# EAGLE design PQ60-EPS (EAGLE 7.2.0)
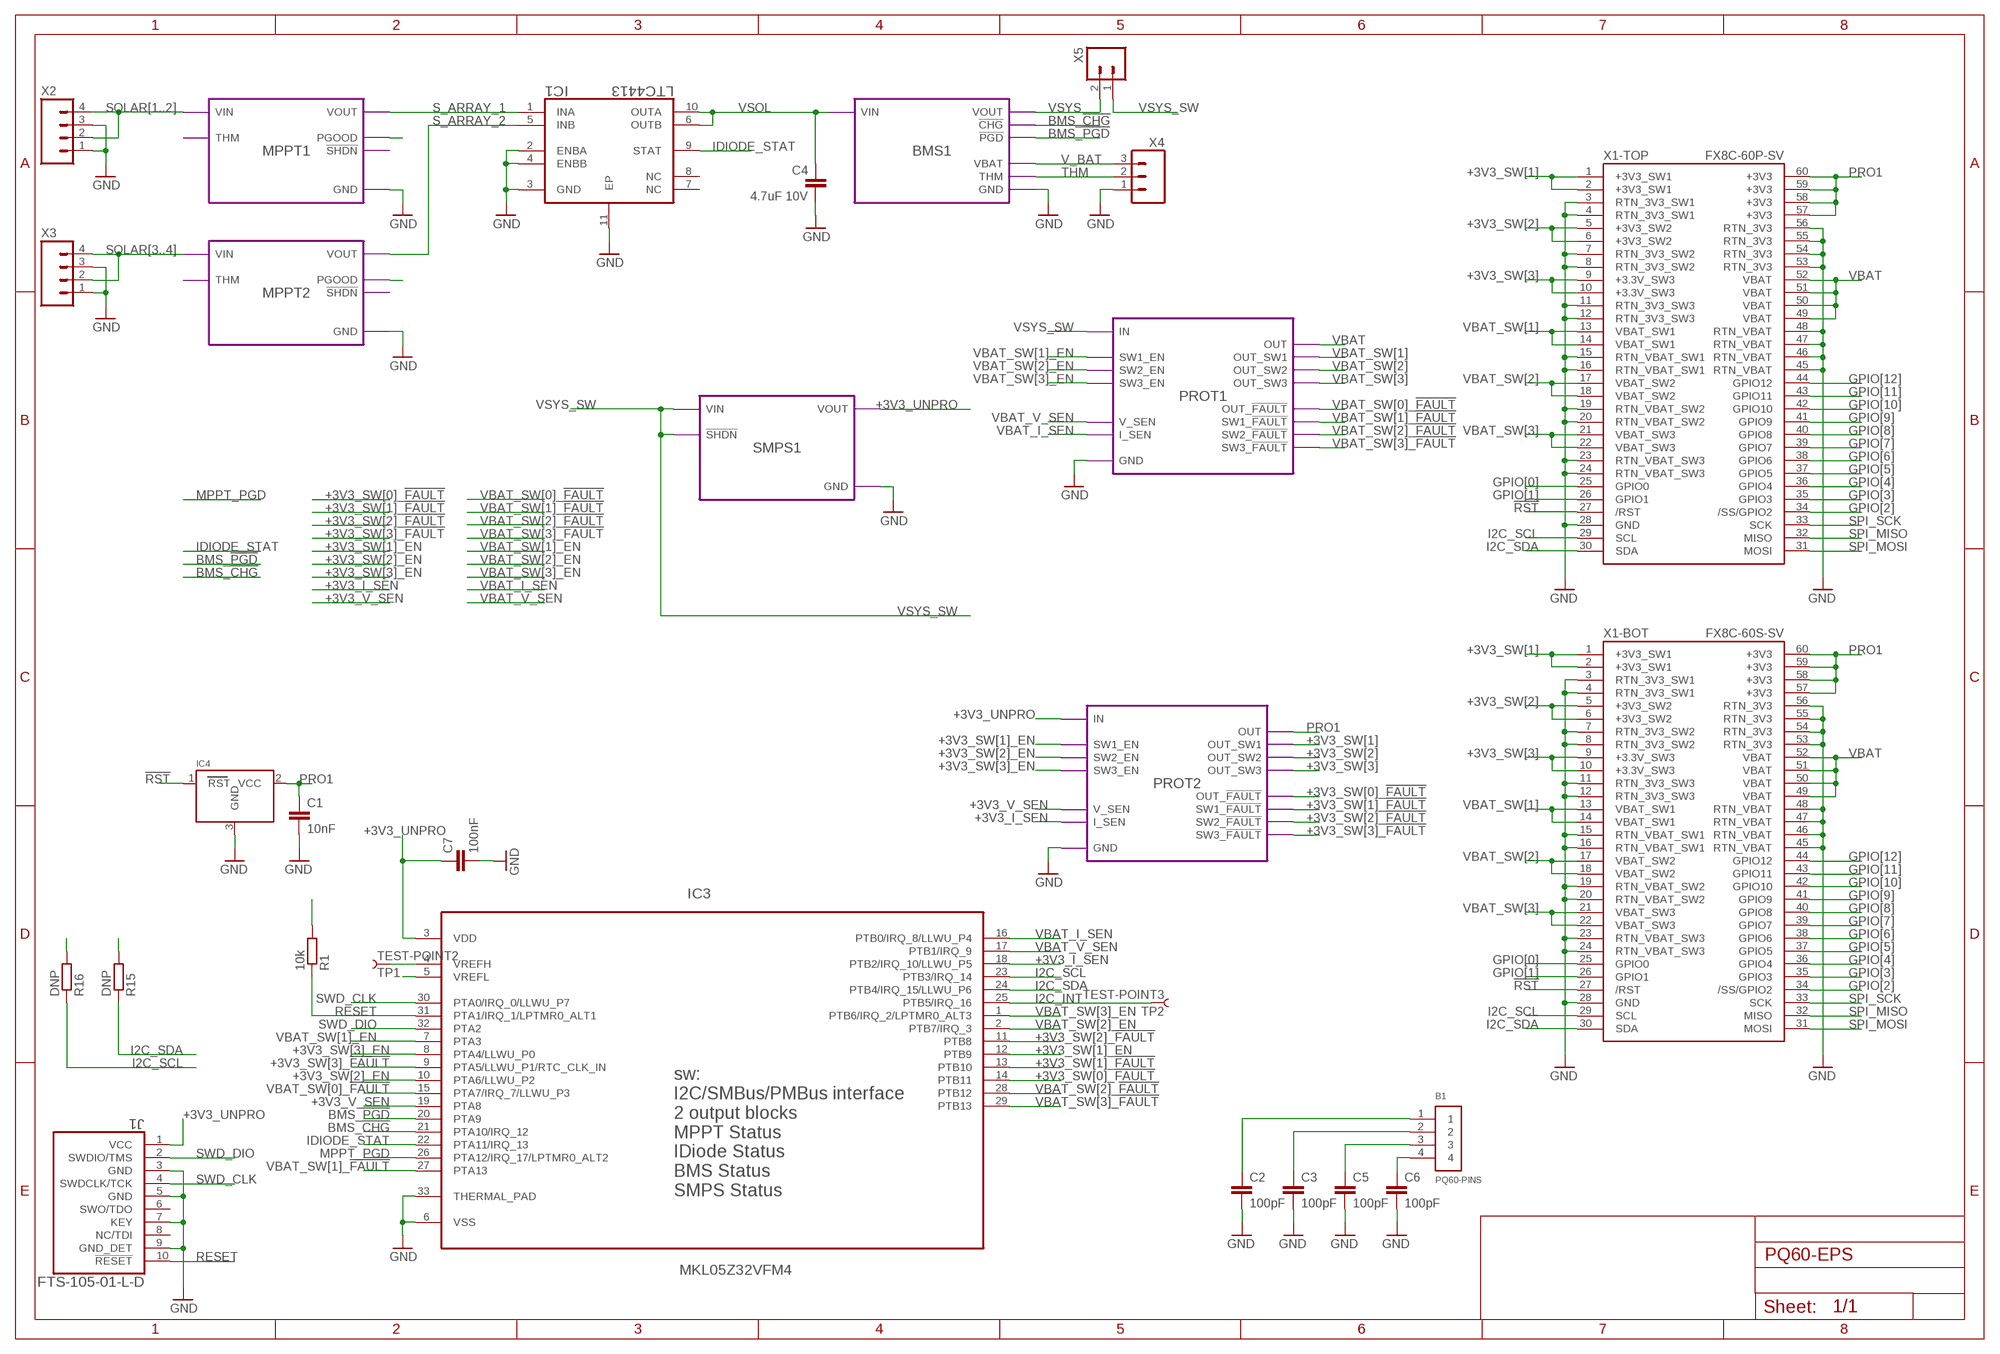
[diagram p0: schematic, sheet 1]

## Parts
B1  PQ60-PINS  [PQ60_PINS]
C1  10nF  C-EUC0603  [C0603]
C2  100pF  C-EUC0402  [C0402]
C3  100pF  C-EUC0402  [C0402]
C4  4.7uF 10V  C-EUC0805  [C0805]
C5  100pF  C-EUC0402  [C0402]
C6  100pF  C-EUC0402  [C0402]
C7  100nF  C-EUC0603  [C0603]
IC1  LTC4413  LTC4413EDDPBF  [DFN300X300X80-11N]
IC3  MKL05Z32VFM4  [QFN50P500X500X100-33N]
IC4  MCP130TREFLOW  [SOT23-R]
J1  FTS-105-01-L-D  [SAMTEC_FTS-105-01-L-D]
R1  10k  R-EU_R0603  [R0603]
R15  DNP  R-EU_R0603  [R0603]
R16  DNP  R-EU_R0603  [R0603]
TP1  TEST-POINT2  [PAD.02X.02]
TP2  TEST-POINT3  [PAD.03X.03]
X1-BOT  FX8C-60S-SV  FX8C-60-R2S-SV  [FX8C-60S-SV]
X1-TOP  FX8C-60P-SV  FX8C-60-R2P-SV  [FX8C-60P-SV]
X2  M04SMD2  [1X04-1MM-RA]
X3  M04SMD2  [1X04-1MM-RA]
X4  M03SMD  [1X03-1MM-RA]
X5  M02SMD  [1X02-1MM-RA]

## Module instances
MPPT1 = MPPT
MPPT2 = MPPT
SMPS1 = SMPS
BMS1 = BMS
PROT1 = PROT
PROT2 = PROT

## Nets
!RST: IC4.1(RST) X1-BOT.27(/RST) X1-TOP.27(/RST)
+3V3_I_SEN: IC3.18(PTB2/IRQ_10/LLWU_P5) ; port PROT2.I_SEN
+3V3_SW[0]_!FAULT!: IC3.14(PTB11) ; port PROT2.OUT_!FAULT!
+3V3_SW[1]: X1-BOT.1(+3V3_SW1) X1-BOT.2(+3V3_SW1) X1-TOP.1(+3V3_SW1) X1-TOP.2(+3V3_SW1) ; port PROT2.OUT_SW1
+3V3_SW[1]_!FAULT!: IC3.13(PTB10) ; port PROT2.SW1_!FAULT!
+3V3_SW[1]_EN: IC3.12(PTB9) ; port PROT2.SW1_EN
+3V3_SW[2]: X1-BOT.5(+3V3_SW2) X1-BOT.6(+3V3_SW2) X1-TOP.5(+3V3_SW2) X1-TOP.6(+3V3_SW2) ; port PROT2.OUT_SW2
+3V3_SW[2]_!FAULT!: IC3.11(PTB8) ; port PROT2.SW2_!FAULT!
+3V3_SW[2]_EN: IC3.10(PTA6/LLWU_P2) ; port PROT2.SW2_EN
+3V3_SW[3]: X1-BOT.9(+3.3V_SW3) X1-BOT.10(+3.3V_SW3) X1-TOP.9(+3.3V_SW3) X1-TOP.10(+3.3V_SW3) ; port PROT2.OUT_SW3
+3V3_SW[3]_!FAULT!: IC3.9(PTA5/LLWU_P1/RTC_CLK_IN) ; port PROT2.SW3_!FAULT!
+3V3_SW[3]_EN: IC3.8(PTA4/LLWU_P0) ; port PROT2.SW3_EN
+3V3_UNPRO: C7.1 IC3.3(VDD) J1.1(VCC) R1.2 ; port SMPS1.VOUT PROT2.IN
+3V3_V_SEN: IC3.19(PTA8) ; port PROT2.V_SEN
BMS_!CHG!: IC3.21(PTA10/IRQ_12) ; port BMS1.!CHG
BMS_!PGD!: IC3.20(PTA9) ; port BMS1.!PGD
GND: C1.2 C2.2 C3.2 C4.2 C5.2 C6.2 C7.2 IC1.2(ENBA) IC1.3(GND) IC1.4(ENBB) IC1.11(EP) IC3.5(VREFL) IC3.6(VSS) IC3.33(THERMAL_PAD) IC4.3(GND) J1.3(GND) J1.5(GND) J1.7(KEY) J1.9(GND_DET) X1-BOT.3(RTN_3V3_SW1) X1-BOT.4(RTN_3V3_SW1) X1-BOT.7(RTN_3V3_SW2) X1-BOT.8(RTN_3V3_SW2) X1-BOT.11(RTN_3V3_SW3) X1-BOT.12(RTN_3V3_SW3) X1-BOT.15(RTN_VBAT_SW1) X1-BOT.16(RTN_VBAT_SW1) X1-BOT.19(RTN_VBAT_SW2) X1-BOT.20(RTN_VBAT_SW2) X1-BOT.23(RTN_VBAT_SW3) X1-BOT.24(RTN_VBAT_SW3) X1-BOT.28(GND) X1-BOT.45(RTN_VBAT) X1-BOT.46(RTN_VBAT) X1-BOT.47(RTN_VBAT) X1-BOT.48(RTN_VBAT) X1-BOT.53(RTN_3V3) X1-BOT.54(RTN_3V3) X1-BOT.55(RTN_3V3) X1-BOT.56(RTN_3V3) X1-TOP.3(RTN_3V3_SW1) X1-TOP.4(RTN_3V3_SW1) X1-TOP.7(RTN_3V3_SW2) X1-TOP.8(RTN_3V3_SW2) X1-TOP.11(RTN_3V3_SW3) X1-TOP.12(RTN_3V3_SW3) X1-TOP.15(RTN_VBAT_SW1) X1-TOP.16(RTN_VBAT_SW1) X1-TOP.19(RTN_VBAT_SW2) X1-TOP.20(RTN_VBAT_SW2) X1-TOP.23(RTN_VBAT_SW3) X1-TOP.24(RTN_VBAT_SW3) X1-TOP.28(GND) X1-TOP.45(RTN_VBAT) X1-TOP.46(RTN_VBAT) X1-TOP.47(RTN_VBAT) X1-TOP.48(RTN_VBAT) X1-TOP.53(RTN_3V3) X1-TOP.54(RTN_3V3) X1-TOP.55(RTN_3V3) X1-TOP.56(RTN_3V3) X2.1 X2.3 X3.1 X3.3 X4.1 ; port MPPT1.GND MPPT2.GND SMPS1.GND BMS1.GND PROT1.GND PROT2.GND
GPIO[0]: X1-BOT.25(GPIO0) X1-TOP.25(GPIO0)
GPIO[1]: X1-BOT.26(GPIO1) X1-TOP.26(GPIO1)
GPIO[2]: X1-BOT.34(/SS/GPIO2) X1-TOP.34(/SS/GPIO2)
GPIO[3]: X1-BOT.35(GPIO3) X1-TOP.35(GPIO3)
GPIO[4]: X1-BOT.36(GPIO4) X1-TOP.36(GPIO4)
GPIO[5]: X1-BOT.37(GPIO5) X1-TOP.37(GPIO5)
GPIO[6]: X1-BOT.38(GPIO6) X1-TOP.38(GPIO6)
GPIO[7]: X1-BOT.39(GPIO7) X1-TOP.39(GPIO7)
GPIO[8]: X1-BOT.40(GPIO8) X1-TOP.40(GPIO8)
GPIO[9]: X1-BOT.41(GPIO9) X1-TOP.41(GPIO9)
GPIO[10]: X1-BOT.42(GPIO10) X1-TOP.42(GPIO10)
GPIO[11]: X1-BOT.43(GPIO11) X1-TOP.43(GPIO11)
GPIO[12]: X1-BOT.44(GPIO12) X1-TOP.44(GPIO12)
I2C_INT: IC3.25(PTB5/IRQ_16) TP2.P$1
I2C_SCL: IC3.23(PTB3/IRQ_14) R16.1 X1-BOT.29(SCL) X1-TOP.29(SCL)
I2C_SDA: IC3.24(PTB4/IRQ_15/LLWU_P6) R15.1 X1-BOT.30(SDA) X1-TOP.30(SDA)
IDIODE_STAT: IC1.9(STAT) IC3.22(PTA11/IRQ_13)
MPPT_PGD: IC3.26(PTA12/IRQ_17/LPTMR0_ALT2) ; port MPPT1.PGOOD MPPT2.PGOOD
N$1: B1.1 C2.1
N$2: B1.2 C3.1
N$3: B1.3 C5.1
N$4: B1.4 C6.1
N$5: IC3.4(VREFH) TP1.P$1
PRO1: C1.1 IC4.2(VCC) R15.2 R16.2 X1-BOT.57(+3V3) X1-BOT.58(+3V3) X1-BOT.59(+3V3) X1-BOT.60(+3V3) X1-TOP.57(+3V3) X1-TOP.58(+3V3) X1-TOP.59(+3V3) X1-TOP.60(+3V3) ; port PROT2.OUT
RESET: IC3.31(PTA1/IRQ_1/LPTMR0_ALT1) J1.10(!RESET) R1.1
S_ARRAY_1: IC1.1(INA) ; port MPPT1.VOUT
S_ARRAY_2: IC1.5(INB) ; port MPPT2.VOUT
SOLAR[1..2]: X2.2 X2.4 ; port MPPT1.VIN
SOLAR[3..4]: X3.2 X3.4 ; port MPPT2.VIN
SPI_MISO: X1-BOT.32(MISO) X1-TOP.32(MISO)
SPI_MOSI: X1-BOT.31(MOSI) X1-TOP.31(MOSI)
SPI_SCK: X1-BOT.33(SCK) X1-TOP.33(SCK)
SWD_CLK: IC3.30(PTA0/IRQ_0/LLWU_P7) J1.4(SWDCLK/TCK)
SWD_DIO: IC3.32(PTA2) J1.2(SWDIO/TMS)
THM: X4.2 ; port BMS1.THM
V_BAT: X4.3 ; port BMS1.VBAT
VBAT: X1-BOT.49(VBAT) X1-BOT.50(VBAT) X1-BOT.51(VBAT) X1-BOT.52(VBAT) X1-TOP.49(VBAT) X1-TOP.50(VBAT) X1-TOP.51(VBAT) X1-TOP.52(VBAT) ; port PROT1.OUT
VBAT_I_SEN: IC3.16(PTB0/IRQ_8/LLWU_P4) ; port PROT1.I_SEN
VBAT_SW[0]_!FAULT!: IC3.15(PTA7/IRQ_7/LLWU_P3) ; port PROT1.OUT_!FAULT!
VBAT_SW[1]: X1-BOT.13(VBAT_SW1) X1-BOT.14(VBAT_SW1) X1-TOP.13(VBAT_SW1) X1-TOP.14(VBAT_SW1) ; port PROT1.OUT_SW1
VBAT_SW[1]_!FAULT!: IC3.27(PTA13) ; port PROT1.SW1_!FAULT!
VBAT_SW[1]_EN: IC3.7(PTA3) ; port PROT1.SW1_EN
VBAT_SW[2]: X1-BOT.17(VBAT_SW2) X1-BOT.18(VBAT_SW2) X1-TOP.17(VBAT_SW2) X1-TOP.18(VBAT_SW2) ; port PROT1.OUT_SW2
VBAT_SW[2]_!FAULT!: IC3.28(PTB12) ; port PROT1.SW2_!FAULT!
VBAT_SW[2]_EN: IC3.2(PTB7/IRQ_3) ; port PROT1.SW2_EN
VBAT_SW[3]: X1-BOT.21(VBAT_SW3) X1-BOT.22(VBAT_SW3) X1-TOP.21(VBAT_SW3) X1-TOP.22(VBAT_SW3) ; port PROT1.OUT_SW3
VBAT_SW[3]_!FAULT!: IC3.29(PTB13) ; port PROT1.SW3_!FAULT!
VBAT_SW[3]_EN: IC3.1(PTB6/IRQ_2/LPTMR0_ALT3) ; port PROT1.SW3_EN
VBAT_V_SEN: IC3.17(PTB1/IRQ_9) ; port PROT1.V_SEN
VSOL: C4.1 IC1.6(OUTB) IC1.10(OUTA) ; port BMS1.VIN
VSYS: X5.2 ; port BMS1.VOUT
VSYS_SW: X5.1 ; port SMPS1.VIN SMPS1.!SHDN PROT1.IN
Unconnected: IC1.7(NC) IC1.8(NC) J1.6(SWO/TDO) J1.8(NC/TDI)

## Notes on the sheet
- sw:
  I2C/SMBus/PMBus interface
  2 output blocks
  MPPT Status
  IDiode Status
  BMS Status
  SMPS Status

## Library data of the parts
B1 = general:PQ60-PINS; OC_FARNELL: unknown
C1 C4 = rcl:C-EU: CAPACITOR, European symbol; OC_FARNELL: unknown
C2 C3 C5 C6 = rcl:C-EU: CAPACITOR, European symbol; MF: AVX; MPN: 02013A101JAT2A; OC_FARNELL: 2280754
C7 = rcl:C-EU: CAPACITOR, European symbol
IC1 = general:LTC4413EDDPBF: Dual 2.6A, 2.5V to 5.5V, Ideal Diodes; MF: LINEAR TECHNOLOGY; MPN: LTC4413EDD#PBF; OC_FARNELL: 1663736; OC_NEWARK: 56M9529; PACKAGE: DFN-10; SUPPLIER: Linear Technology
IC3 = general:MKL05Z32VFM4: MCU, KINETIS L, CORTEX M0+, QFN-32; MF: FREESCALE SEMICONDUCTOR; MPN: MKL05Z32VFM4; OC_FARNELL: 2253370; OC_NEWARK: 53W0789; PACKAGE: QFN-32; SUPPLIER: FREESCALE SEMICONDUCTOR
IC4 = microbuilder:MCP130T: MCP130T Voltage Supervisor (Active Low) Voltage supervisors will put the MCU in a reset state if the voltage drops below a pre-determined level. SOT23-R/SOT23-W: Voltage Supervisor - 3.15V Active Low Note: Use the "Reflow" footprint when working with solder paste, and the "Wave" footprint when soldering by hand with a soldering iron (the latter has larger pads that are easier to solder by hand). Digikey: MCP130T-315I/TTCT-ND; OC_FARNELL: unknown
J1 = general:FTS-105-01-L-; DESCRIPTION: Through Hole Post Header; MF: SAMTEC; MPN: FTS-105-01-L-D; OC_FARNELL: 1667728; OC_NEWARK: 11P4652; PACKAGE: CONN HEADER 10POS DUAL .05" THR; SUPPLIER: Samtec
R1 R15 R16 = rcl:R-EU_: RESISTOR, European symbol; OC_FARNELL: unknown
TP1 TP2 = SparkFun-Passives:TEST-POINT: Bare copper test points for troubleshooting or ICT
X1-BOT X1-TOP = PQ60:FX8C-60-R2; OC_FARNELL: unknown
X2 X3 = SparkFun-Connectors:M04: Header 4 Standard 4-pin 0.1" header. Use with straight break away headers (SKU : PRT-00116), right angle break away headers (PRT-00553), swiss pins (PRT-00743), machine pins (PRT-00117), and female headers (PRT-00115). Molex polarized connector foot print use with SKU : PRT-08231 with associated crimp pins and housings. 1MM SMD Version SKU: PRT-10208; OC_FARNELL: unknown
X4 = SparkFun-Connectors:M03: Header 3 Standard 3-pin 0.1" header. Use with straight break away headers (SKU : PRT-00116), right angle break away headers (PRT-00553), swiss pins (PRT-00743), machine pins (PRT-00117), and female headers (PRT-00115). Molex polarized connector foot print use with SKU : PRT-08232 with associated crimp pins and housings.; OC_FARNELL: unknown
X5 = SparkFun-Connectors:M02: Standard 2-pin 0.1" header. Use with - straight break away headers ( PRT-00116) - right angle break away headers (PRT-00553) - swiss pins (PRT-00743) - machine pins (PRT-00117) - female headers (PRT-00115) Molex polarized connector foot print use with: PRT-08233 with associated crimp pins and housings. 2.54_SCREWTERM for use with PRT-10571. 3.5mm Screw Terminal footprints for PRT-08084 5mm Screw Terminal footprints for use with PRT-08432; OC_FARNELL: unknown

## Module MPPT
Ports: GND(pwr) VOUT(out) VIN(in) THM(in) PGOOD(out) !SHDN!(in)
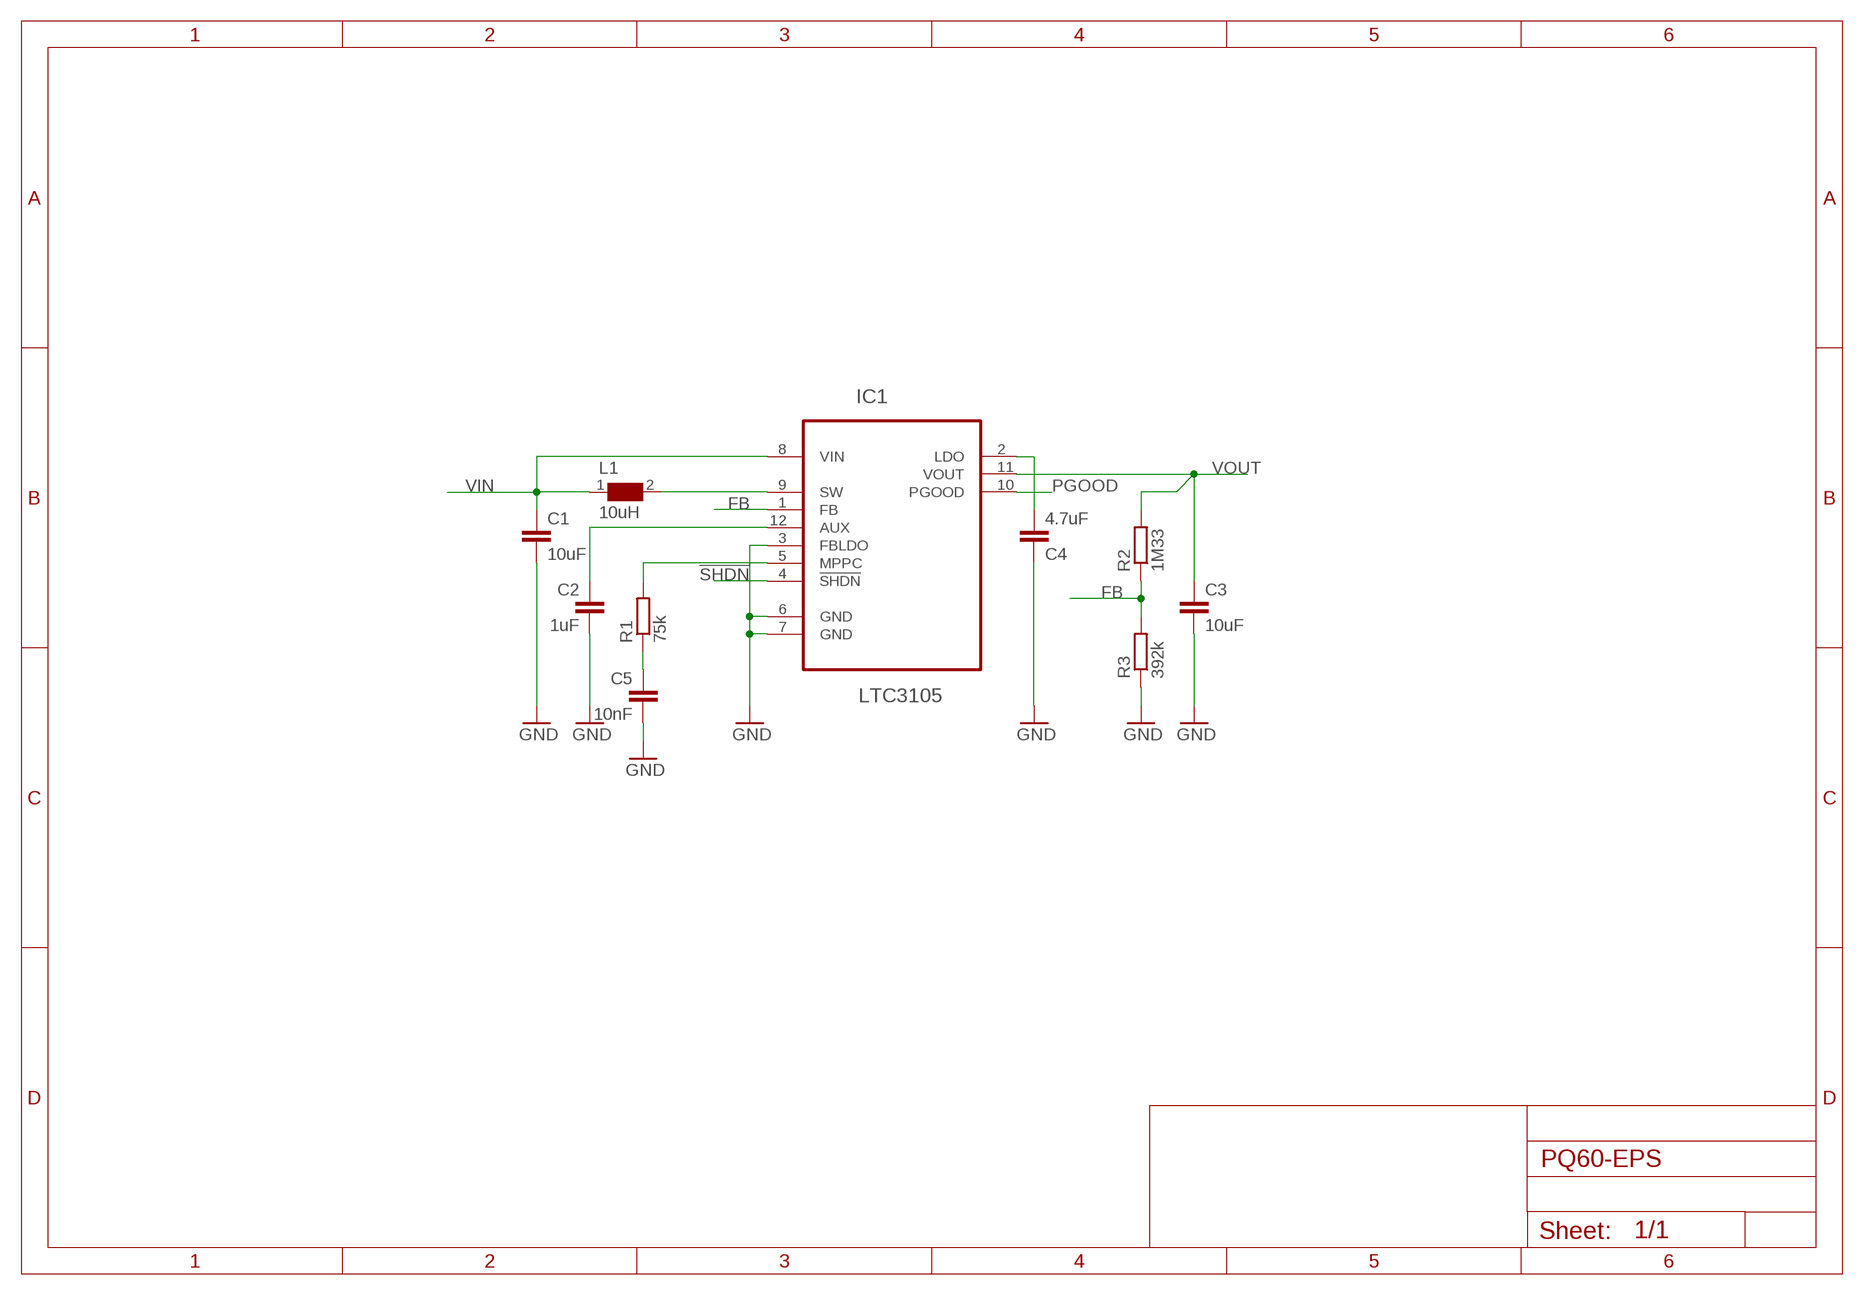
[diagram p1: schematic, module MPPT, sheet 1]

### Parts
C1  10uF  C-EUC0603  [C0603]
C2  1uF  C-EUC0603  [C0603]
C3  10uF  C-EUC0603  [C0603]
C4  4.7uF  C-EUC0603  [C0603]
C5  10nF  C-EUC0603  [C0603]
IC1  LTC3105  LTC3105EMSPBF  [SOP65P490X110-12N]
L1  10uH  WE-TPC-744031100_3816  [WE-TPC_3816]
R1  75k  R-EU_R0603  [R0603]
R2  1M33  R-EU_R0603  [R0603]
R3  392k  R-EU_R0603  [R0603]

### Nets
!SHDN!: IC1.4(!SHDN!)
AUX: C2.1 IC1.12(AUX)
FB: IC1.1(FB) R2.1 R3.2
GND: C1.2 C2.2 C3.2 C4.1 C5.2 IC1.3(FBLDO) IC1.6(GND) IC1.7(GND) R3.1
LDO: C4.2 IC1.2(LDO)
MPPC: IC1.5(MPPC) R1.2
PGOOD: IC1.10(PGOOD)
SW: IC1.9(SW) L1.2
THM: C5.1 R1.1
VIN: C1.1 IC1.8(VIN) L1.1
VOUT: C3.1 IC1.11(VOUT) R2.2

### Library data of the parts
C1 C3-C5 = rcl:C-EU: CAPACITOR, European symbol; OC_FARNELL: unknown
C2 = rcl:C-EU: CAPACITOR, European symbol; MF: AVX; MPN: 02016D105MAT2A; OC_FARNELL: 1867951RL
IC1 = general:LTC3105EMSPBF: DC/DC Converter; MF: LINEAR TECHNOLOGY; MPN: LTC3105EMS#PBF; OC_FARNELL: 1898601; OC_NEWARK: 27T5811; PACKAGE: MSOP-12; SUPPLIER: Linear Technology
L1 = WE-TPC:WE-TPC: Shielded Tiny Power Inductor WE-TPC - Extremely flat power inductor - High current capability - High reliability and perfect soldering characteristics because of integrated soldering pad - magnetically shielded -- Portable power like PDA, digital camera, PCMICA-cards and displays -- DC/DC-converter -- Recommended for switching regulator IC's from Linear Technology, National Semiconductor, Texas Instruments and Fairchild Semiconductor; MF: WURTH ELEKTRONIK; MPN: 744031100; OC_FARNELL: 1635835; OC_NEWARK: 08P2474; PACKAGE: 3816; SUPPLIER: WURTH ELEKTRONIK
R1-R3 = rcl:R-EU_: RESISTOR, European symbol; OC_FARNELL: unknown

## Module SMPS
Ports: VIN(in) VOUT(out) GND(pwr) !SHDN(in)
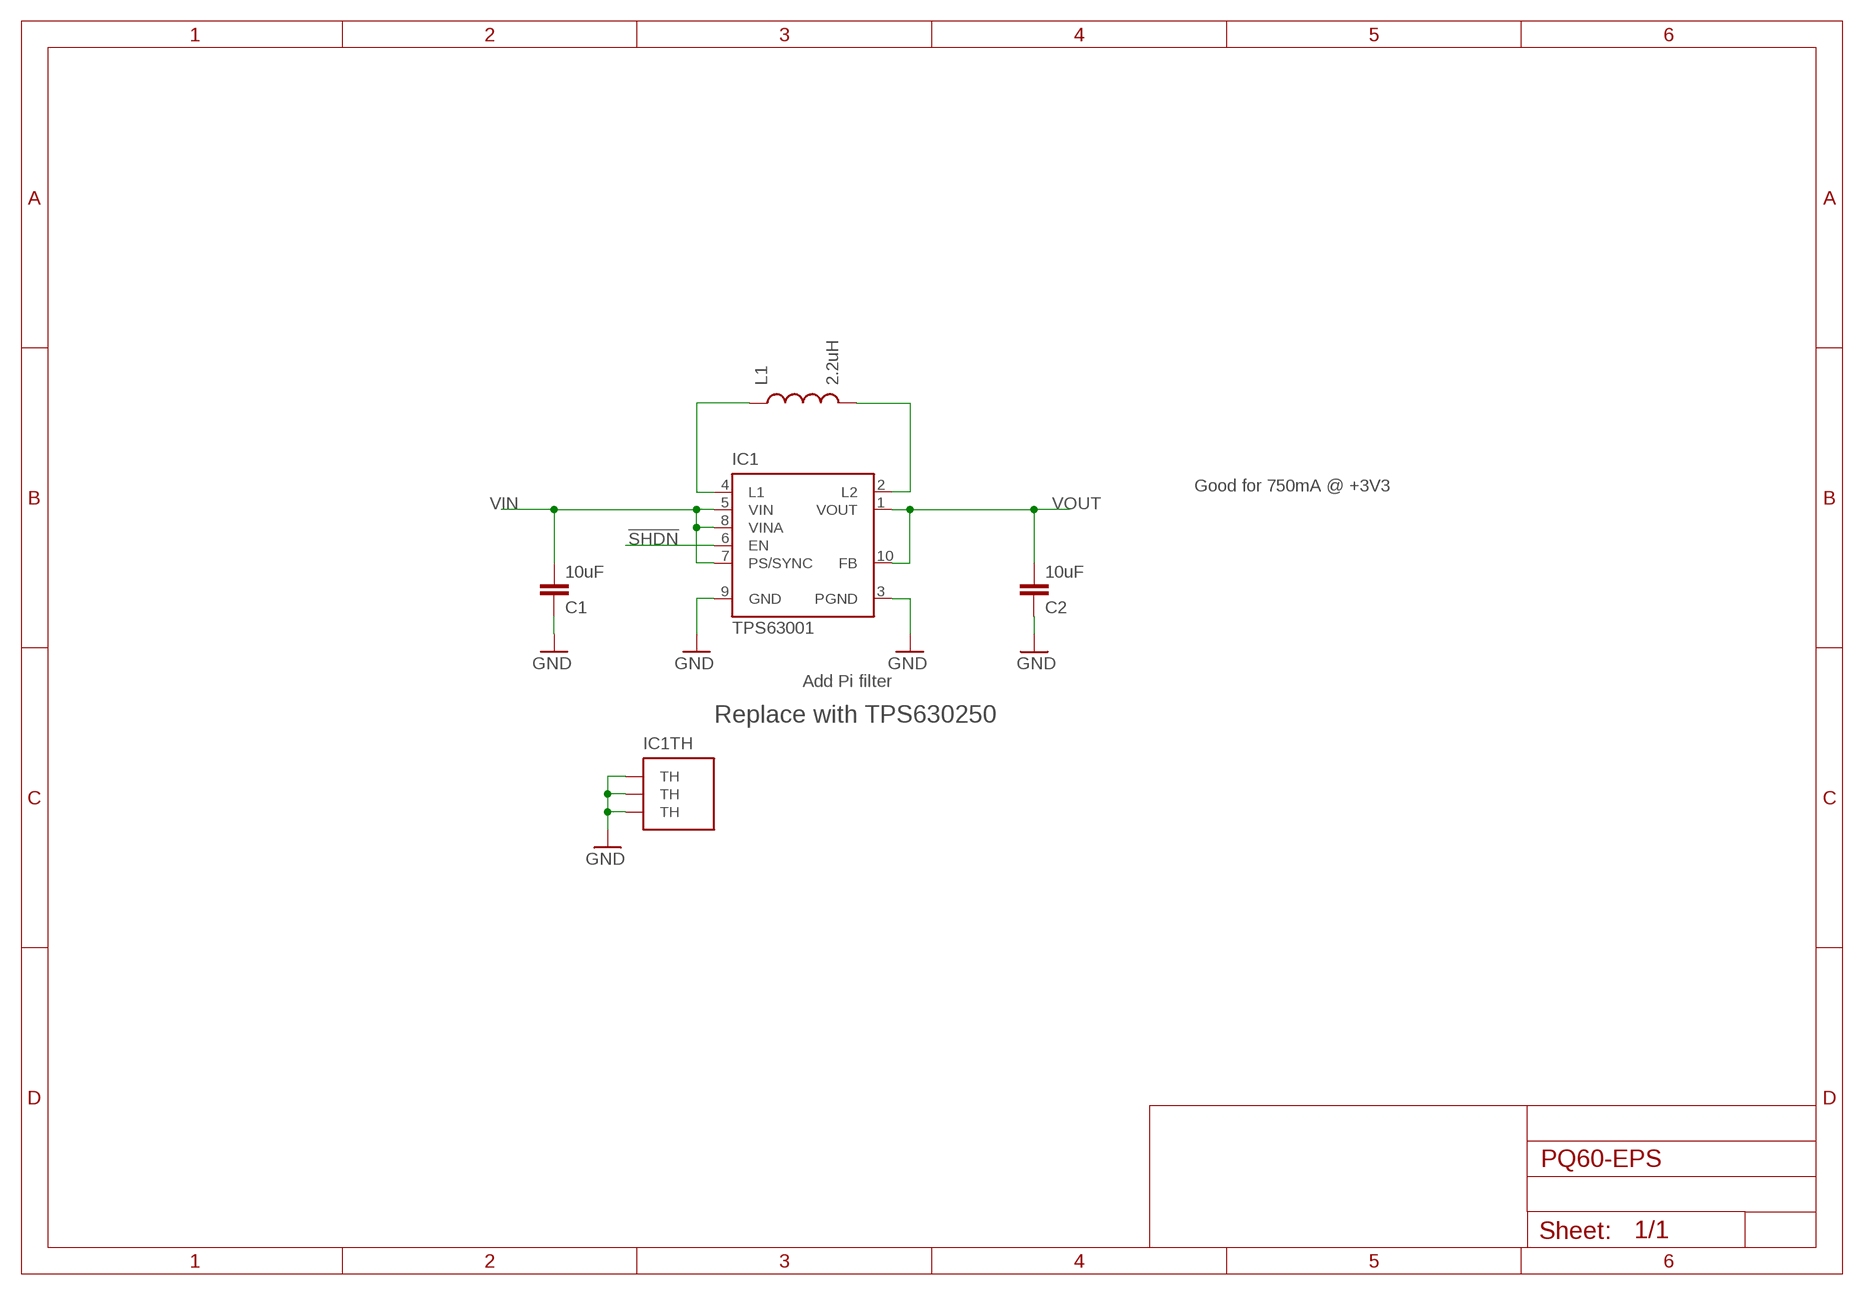
[diagram p2: schematic, module SMPS, sheet 1]

### Parts
C1  10uF  C-EUC0805  [C0805]
C2  10uF  C-EUC0805  [C0805]
IC1  TPS63001  TPS6300  [DRC-S-PVSON-N10]
L1  2.2uH  INDUCTORVLF4012A  [VLF4012A]

### Nets
!SHDN: IC1.6(EN)
GND: C1.1 C2.1 IC1.3(PGND) IC1.9(GND) IC1.TH IC1.TH@1(TH) IC1.TH@2(TH)
N$1: IC1.4(L1) L1.P$1
N$2: IC1.2(L2) L1.P$2
VIN: C1.2 IC1.5(VIN) IC1.7(PS/SYNC) IC1.8(VINA)
VOUT: C2.2 IC1.1(VOUT) IC1.10(FB)

### Notes on the sheet
- Good for 750mA @ +3V3
- Add Pi filter
- Replace with TPS630250

### Library data of the parts
C1 C2 = rcl:C-EU: CAPACITOR, European symbol; OC_FARNELL: unknown
IC1 = texas:TPS6300*: HIGH EFFICIENT SINGLE INDUCTOR BUCK-BOOST CONVERTER WITH 1.8-A SWITCHES Source: http://focus.ti.com/lit/ds/symlink/tps63001.pdf; MF: TEXAS INSTRUMENTS; MPN: TPS63001DRCT; OC_FARNELL: 1652399
L1 = SparkFun-Passives:INDUCTOR: Inductors Basic Inductor/Choke - 0603 and 1206. Footprints are not proven and vary greatly between part numbers. SRN6045- 33uH, 20% 1.4A SDR0403-560KL - 56uH, 10%, 500mA RMS/740mA peak; MF: TDK; MPN: VLF4012AT-2R2M1R5; OC_FARNELL: 1670126

## Module IDIODE
Ports: GND(pwr) VOUT(out) STAT1(out) STAT2(out) VIN1(in) VIN2(in) VIN3(in) VIN4(in)

### Library data of the parts

## Module BMS
Ports: GND(pwr) VIN(in) VOUT(out) VBAT(out) THM(in) !CHG(out) !PGD(out)
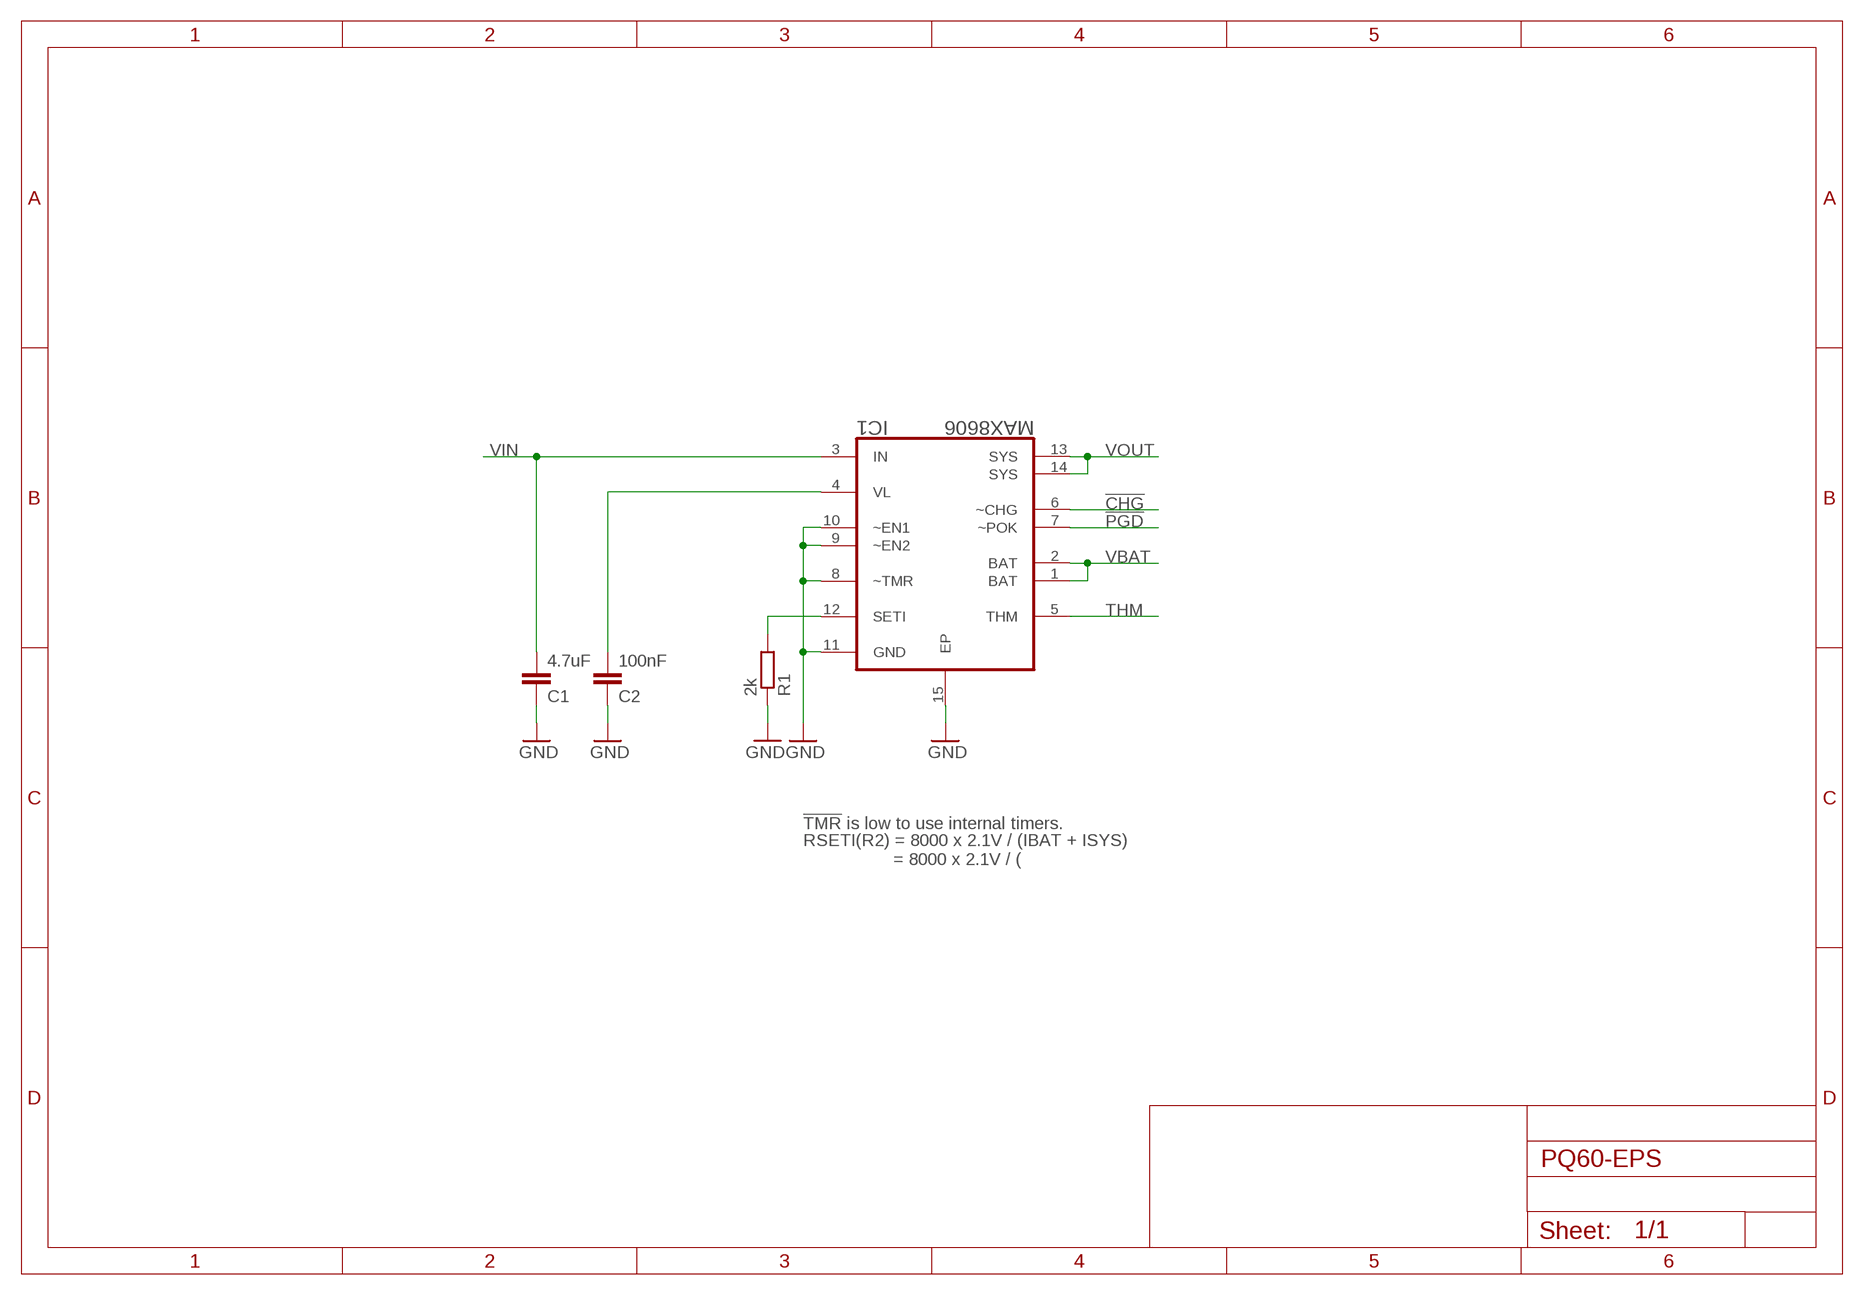
[diagram p3: schematic, module BMS, sheet 1]

### Parts
C1  4.7uF  C-EUC0603  [C0603]
C2  100nF  C-EUC0603  [C0603]
IC1  MAX8606  MAX8606ETD+T  [DFN300X300X80-15N]
R1  2k  R-EU_R0603  [R0603]

### Nets
!CHG: IC1.6(~CHG)
!PGD: IC1.7(~POK)
BATT_PROG: IC1.12(SETI) R1.2
GND: C1.1 C2.1 IC1.8(~TMR) IC1.9(~EN2) IC1.10(~EN1) IC1.11(GND) IC1.15(EP) R1.1
THM: IC1.5(THM)
VBAT: IC1.1(BAT) IC1.2(BAT)
VIN: C1.2 IC1.3(IN)
VL: C2.2 IC1.4(VL)
VOUT: IC1.13(SYS) IC1.14(SYS)

### Notes on the sheet
- !TMR! is low to use internal timers.
- RSETI(R2) = 8000 x 2.1V / (IBAT + ISYS)
                    = 8000 x 2.1V / (

### Library data of the parts
C1 C2 = rcl:C-EU: CAPACITOR, European symbol; OC_FARNELL: unknown
IC1 = general:MAX8606ETD+T: USB/AC Adapter, Li+ Linear Battery Charger with Integrated 50mÙ Battery Switch; MF: MAXIM INTEGRATED PRODUCTS; MPN: MAX8606ETD+T; OC_FARNELL: 1628234; OC_NEWARK: 68K5050; PACKAGE: DFN-14; SUPPLIER: Maxim
R1 = rcl:R-EU_: RESISTOR, European symbol; OC_FARNELL: unknown

## Module PROT
Ports: IN(in) OUT(out) V_SEN(out) I_SEN(out) GND(pwr) OUT_!FAULT!(out) SW1_!FAULT!(out) SW2_!FAULT!(out) SW3_!FAULT!(out) OUT_SW1(out) OUT_SW2(out) OUT_SW3(out) SW1_EN(in) SW2_EN(in) SW3_EN(in)
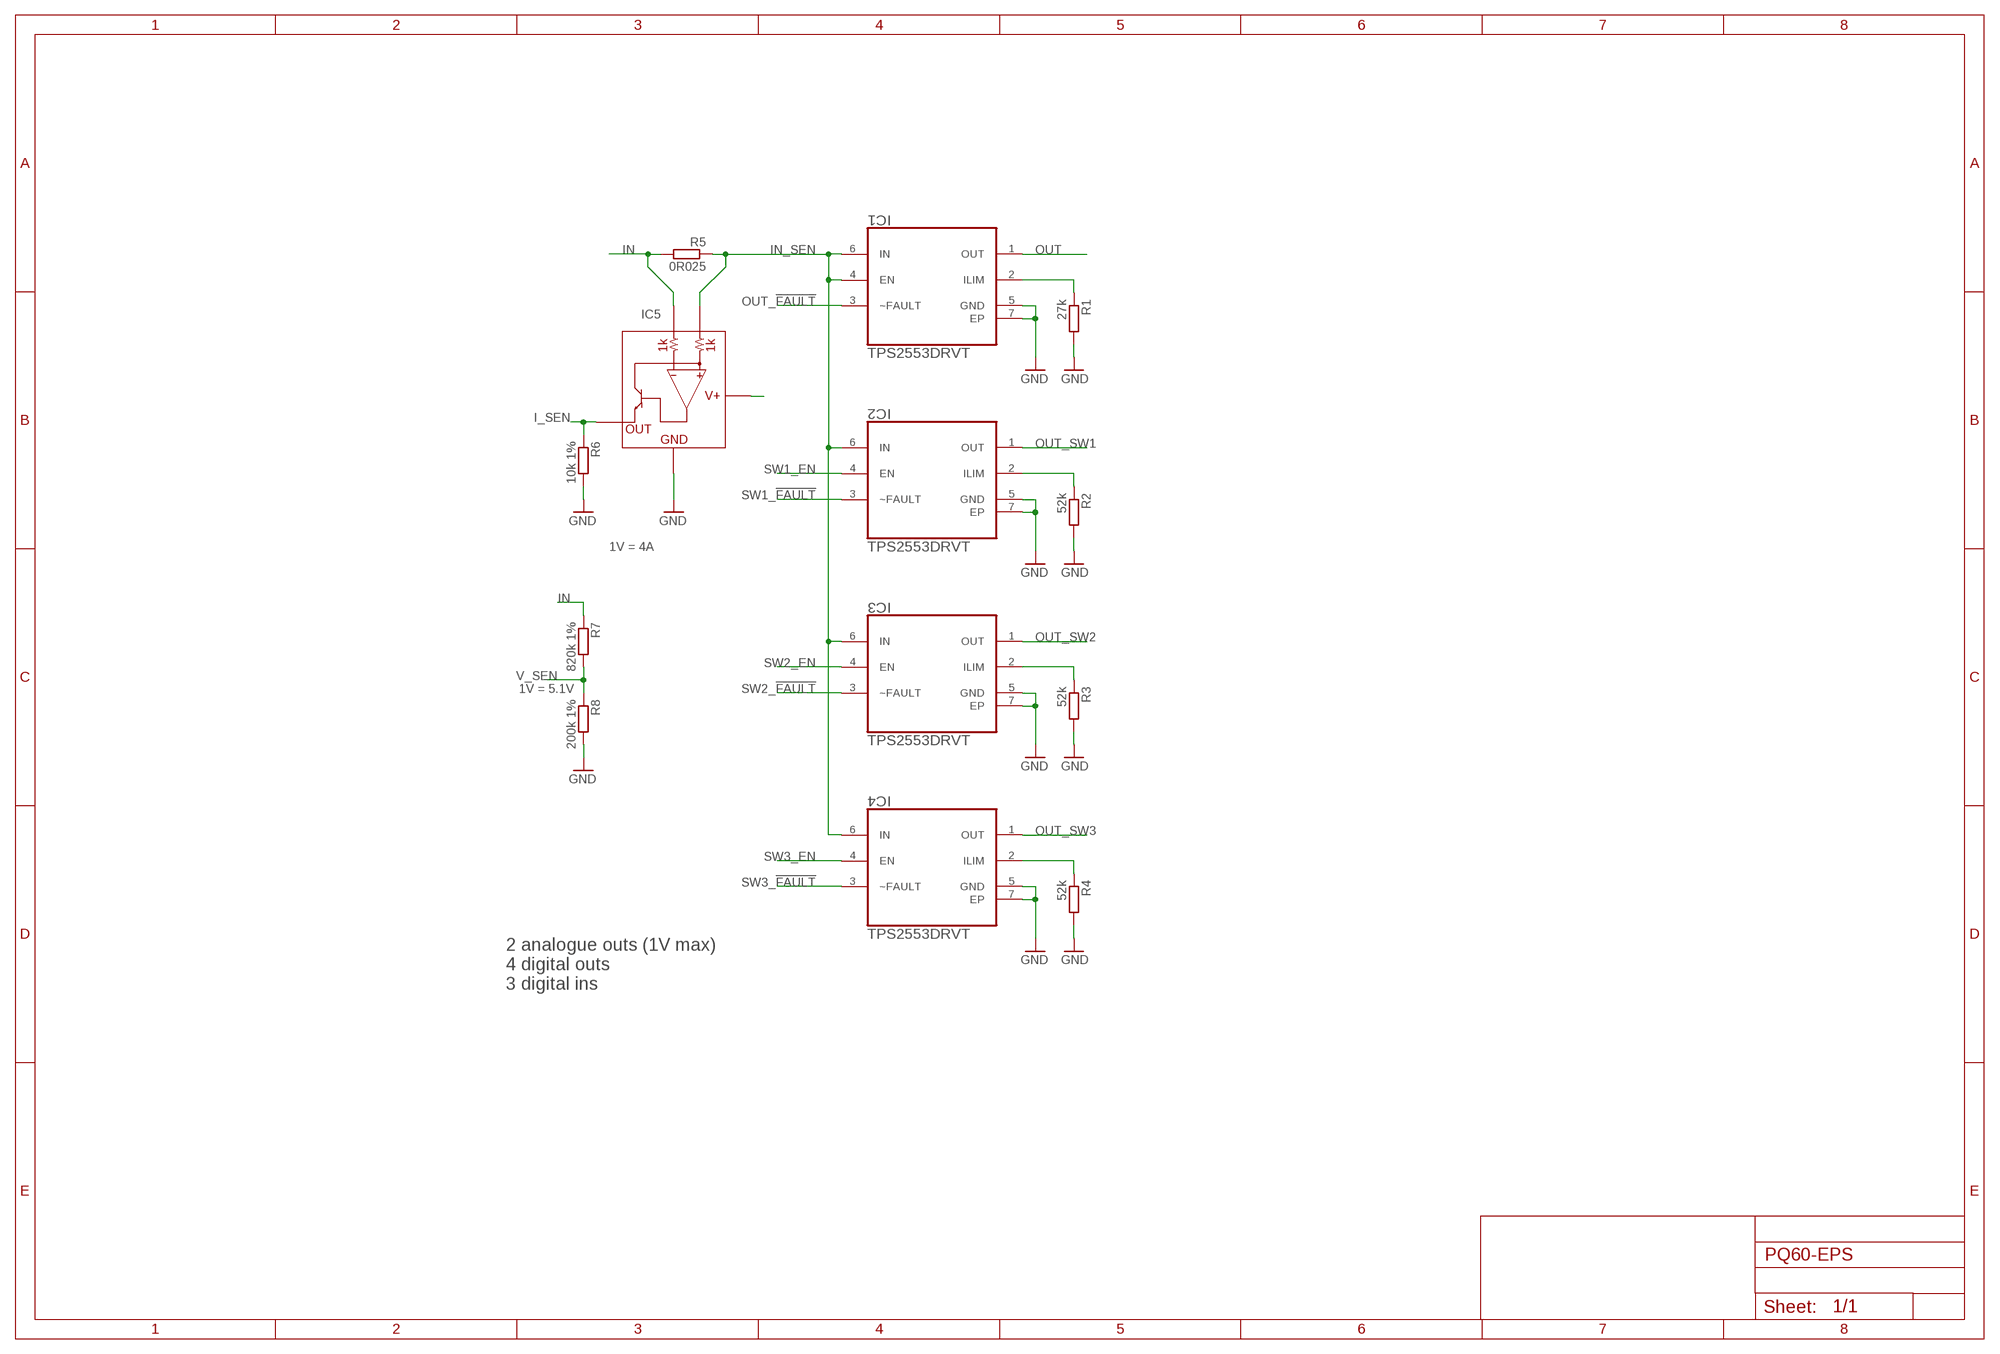
[diagram p4: schematic, module PROT, sheet 1]

### Parts
IC1  TPS2553DRVT  [SON65P200X200X80-7N]
IC2  TPS2553DRVT  [SON65P200X200X80-7N]
IC3  TPS2553DRVT  [SON65P200X200X80-7N]
IC4  TPS2553DRVT  [SON65P200X200X80-7N]
IC5  INA139  [SOT23-5]
R1  27k  R-EU_R0603  [R0603]
R2  52k  R-EU_R0603  [R0603]
R3  52k  R-EU_R0603  [R0603]
R4  52k  R-EU_R0603  [R0603]
R5  0R025  R-EU_R1206  [R1206]
R6  10k 1%  R-EU_R0603  [R0603]
R7  820k 1%  R-EU_R0603  [R0603]
R8  200k 1%  R-EU_R0603  [R0603]

### Nets
GND: IC1.5(GND) IC1.7(EP) IC2.5(GND) IC2.7(EP) IC3.5(GND) IC3.7(EP) IC4.5(GND) IC4.7(EP) IC5.2(GND) R1.2 R2.2 R3.2 R4.2 R6.2 R8.2
I_LIM_SW1: IC2.2(ILIM) R2.1
I_LIM_SW2: IC3.2(ILIM) R3.1
I_LIM_SW3: IC4.2(ILIM) R4.1
I_LIM_VCC: IC1.2(ILIM) R1.1
I_SEN: IC5.1(OUT) R6.1
IN: IC5.4(VIN-) IC5.5(V+) R5.2 R7.1
IN_SEN: IC1.4(EN) IC1.6(IN) IC2.6(IN) IC3.6(IN) IC4.6(IN) IC5.3(VIN+) R5.1
OUT: IC1.1(OUT)
OUT_!FAULT!: IC1.3(~FAULT)
OUT_SW1: IC2.1(OUT)
OUT_SW2: IC3.1(OUT)
OUT_SW3: IC4.1(OUT)
SW1_!FAULT!: IC2.3(~FAULT)
SW1_EN: IC2.4(EN)
SW2_!FAULT!: IC3.3(~FAULT)
SW2_EN: IC3.4(EN)
SW3_!FAULT!: IC4.3(~FAULT)
SW3_EN: IC4.4(EN)
V_SEN: R7.2 R8.1

### Notes on the sheet
- 1V = 4A
- 1V = 5.1V
- 2 analogue outs (1V max)
  4 digital outs
  3 digital ins

### Library data of the parts
IC1-IC4 = general:TPS2553DRVT: POWER-DISTRIBUTION SWITCHES; MF: TEXAS INSTRUMENTS; MPN: TPS2553DRVT; OC_FARNELL: 1694427; OC_NEWARK: 40P3872; PACKAGE: SON-6; SUPPLIER: TEXAS INSTRUMENTS
IC5 = SparkFun-AnalogIC:INA139: High-side shunt current sense 2.7V-40V, 1%; OC_FARNELL: unknown
R1-R8 = rcl:R-EU_: RESISTOR, European symbol; OC_FARNELL: unknown

## Board
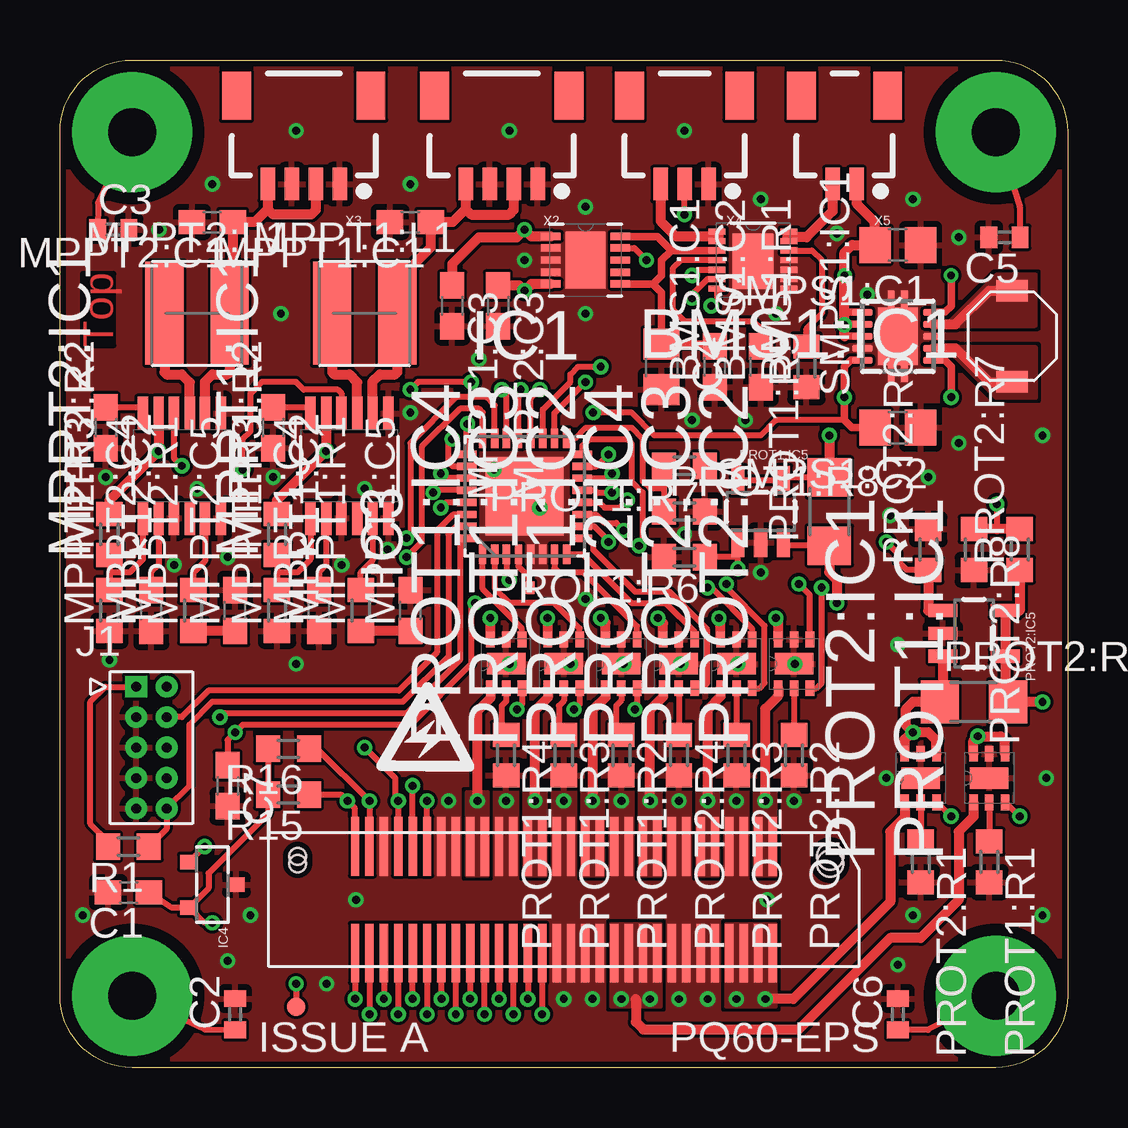
[diagram p5: board, top side]
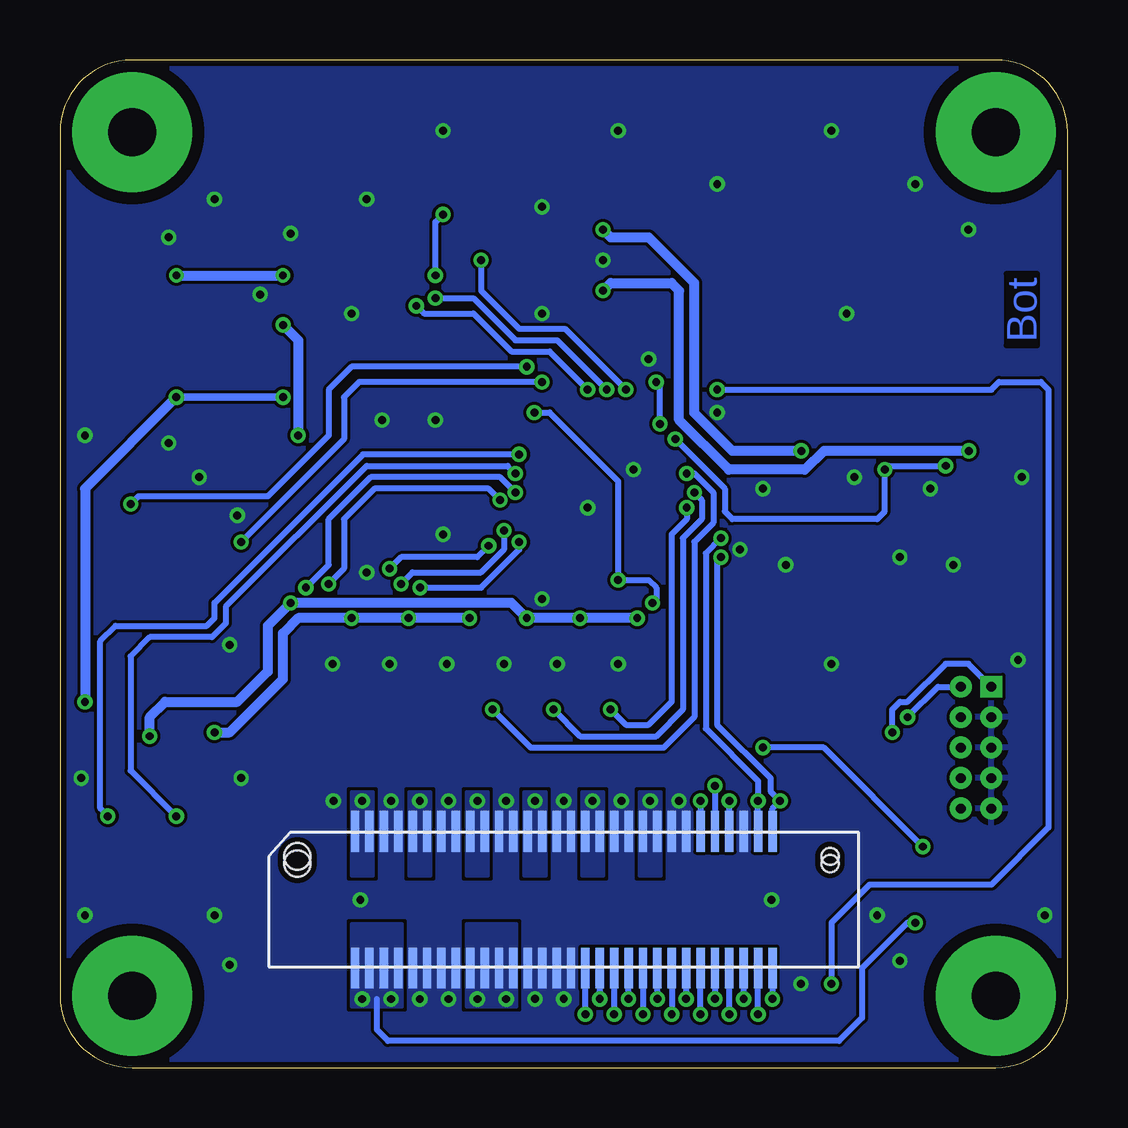
[diagram p6: board, bottom side, seen from below]

Size 42 x 42 mm. Coordinates in mm from the lower left corner, seen from the top.
Copper layers (1*16): Top 0.035mm / dielectric 1.5mm / Bottom 0.035mm
Design rules "dirt_cheap_dirty_boards.v1": minimum track width 5mil, minimum drill 12mil, track to track 5mil, track to pad 5mil, pad to pad 5mil, via to via 5mil, smd to smd 0mil, copper to edge 10mil, drill to drill 10mil, minimum pad ring 10mil, minimum via ring 6mil, stop-mask expansion 2mil, vias tented up to drill 25mil, thermal gap 10mil

### Footprints (pad centres in the part's own frame; a part is rotated, then mirrored left to right if it is on the bottom)
PQ60_PINS = drill 2 pad 5: 1 3,3; 2 3,39; 3 39,39; 4 39,3
C0603 = smd 1.1 x 1: 1 -0.85,0; 2 0.85,0
DFN300X300X80-15N = smd 0.711 x 0.254: 1 -1.499,1.194; 2 -1.499,0.787; 3 -1.499,0.406; 4 -1.499,0; 5 -1.499,-0.406; 6 -1.499,-0.787; 7 -1.499,-1.194; 8 1.499,-1.194; 9 1.499,-0.787; 10 1.499,-0.406; 11 1.499,0; 12 1.499,0.406; 13 1.499,0.787; 14 1.499,1.194 | smd 1.702 x 2.311: 15 0,-0.051
R0603 = smd 1 x 1.1: 1 -0.85,0; 2 0.85,0
C0402 = smd 0.7 x 0.9: 1 -0.65,0; 2 0.65,0
C0805 = smd 1.3 x 1.5: 1 -0.95,0; 2 0.95,0
DFN300X300X80-11N = smd 0.813 x 0.305: 1 -1.448,0.991; 2 -1.448,0.508; 3 -1.448,0; 4 -1.448,-0.508; 5 -1.448,-0.991; 6 1.448,-0.991; 7 1.448,-0.508; 8 1.448,0; 9 1.448,0.508; 10 1.448,0.991 | smd 1.651 x 2.388: 11 0,0
QFN50P500X500X100-33N = smd 0.813 x 0.305: 1 -2.413,1.753; 2 -2.413,1.245; 3 -2.413,0.762; 4 -2.413,0.254; 5 -2.413,-0.254; 6 -2.413,-0.762; 7 -2.413,-1.245; 8 -2.413,-1.753; 17 2.413,-1.753; 18 2.413,-1.245; 19 2.413,-0.762; 20 2.413,-0.254; 21 2.413,0.254; 22 2.413,0.762; 23 2.413,1.245; 24 2.413,1.753 | smd 0.305 x 0.813: 9 -1.753,-2.413; 10 -1.245,-2.413; 11 -0.762,-2.413; 12 -0.254,-2.413; 13 0.254,-2.413; 14 0.762,-2.413; 15 1.245,-2.413; 16 1.753,-2.413; 25 1.753,2.413; 26 1.245,2.413; 27 0.762,2.413; 28 0.254,2.413; 29 -0.254,2.413; 30 -0.762,2.413; 31 -1.245,2.413; 32 -1.753,2.413 | smd 3.251 x 3.251: 33 0,0
SOT23-R = smd 0.6 x 0.7: 1 -0.95,-1; 2 0.95,-1; 3 0,1
SAMTEC_FTS-105-01-L-D = drill 0.406 square: 1 -2.54,-0.635 | drill 0.406: 2 -2.54,0.635; 3 -1.27,-0.635; 4 -1.27,0.635; 5 0,-0.635; 6 0,0.635; 7 1.27,-0.635; 8 1.27,0.635; 9 2.54,-0.635; 10 2.54,0.635
SOP65P490X110-12N = smd 1.397 x 0.432: 1 -2.184,1.626; 2 -2.184,0.965; 3 -2.184,0.33; 4 -2.184,-0.33; 5 -2.184,-0.965; 6 -2.184,-1.626; 7 2.184,-1.626; 8 2.184,-0.965; 9 2.184,-0.33; 10 2.184,0.33; 11 2.184,0.965; 12 2.184,1.626
WE-TPC_3816 = smd 1.6 x 4.3: 1 -1.356,-0.014; 2 1.356,-0.014
SON65P200X200X80-7N = smd 0.66 x 0.356: 1 -1.016,0.66; 2 -1.016,0; 3 -1.016,-0.66; 4 1.016,-0.66; 5 1.016,0; 6 1.016,0.66 | smd 0.889 x 1.6: 7 0,0
SOT23-5 = smd 0.55 x 1.2: 1 -0.95,-1.3; 2 0,-1.3; 3 0.95,-1.3; 4 0.95,1.3; 5 -0.95,1.3
R1206 = smd 1.6 x 1.803: 1 -1.422,0; 2 1.422,0
DRC-S-PVSON-N10 = smd 0.28 x 0.85: 1 -1,-1.475; 2 -0.5,-1.475; 3 0,-1.475; 4 0.5,-1.475; 5 1,-1.475; 6 1,1.475; 7 0.5,1.475; 8 0,1.475; 9 -0.5,1.475; 10 -1,1.475 | smd 2.4 x 1.65: TH 0,0 | smd 3.8 x 0.28: TH@1 0,0.275; TH@2 0,-0.275
VLF4012A = smd 0.9 x 1.3: P$1 -1.9,0; P$2 1.9,0
PAD.02X.02 = smd 0.508 x 0.508: P$1 0,0
PAD.03X.03 = smd 0.762 x 0.762: P$1 0,0
FX8C-60S-SV = smd 0.35 x 1.7: 1 -8.7,2.85; 2 -8.1,2.85; 3 -7.5,2.85; 4 -6.9,2.85; 5 -6.3,2.85; 6 -5.7,2.85; 7 -5.1,2.85; 8 -4.5,2.85; 9 -3.9,2.85; 10 -3.3,2.85; 11 -2.7,2.85; 12 -2.1,2.85; 13 -1.5,2.85; 14 -0.9,2.85; 15 -0.3,2.85; 16 0.3,2.85; 17 0.9,2.85; 18 1.5,2.85; 19 2.1,2.85; 20 2.7,2.85; 21 3.3,2.85; 22 3.9,2.85; 23 4.5,2.85; 24 5.1,2.85; 25 5.7,2.85; 26 6.3,2.85; 27 6.9,2.85; 28 7.5,2.85; 29 8.1,2.85; 30 8.7,2.85; 31 8.7,-2.85; 32 8.1,-2.85; 33 7.5,-2.85; 34 6.9,-2.85; 35 6.3,-2.85; 36 5.7,-2.85; 37 5.1,-2.85; 38 4.5,-2.85; 39 3.9,-2.85; 40 3.3,-2.85; 41 2.7,-2.85; 42 2.1,-2.85; 43 1.5,-2.85; 44 0.9,-2.85; 45 0.3,-2.85; 46 -0.3,-2.85; 47 -0.9,-2.85; 48 -1.5,-2.85; 49 -2.1,-2.85; 50 -2.7,-2.85; 51 -3.3,-2.85; 52 -3.9,-2.85; 53 -4.5,-2.85; 54 -5.1,-2.85; 55 -5.7,-2.85; 56 -6.3,-2.85; 57 -6.9,-2.85; 58 -7.5,-2.85; 59 -8.1,-2.85; 60 -8.7,-2.85 | hole 1.1: -11.1,1.8 | hole 0.7: 11.1,1.8
FX8C-60P-SV = smd 0.35 x 2.45: 1 -8.7,-2.225; 2 -8.1,-2.225; 3 -7.5,-2.225; 4 -6.9,-2.225; 5 -6.3,-2.225; 6 -5.7,-2.225; 7 -5.1,-2.225; 8 -4.5,-2.225; 9 -3.9,-2.225; 10 -3.3,-2.225; 11 -2.7,-2.225; 12 -2.1,-2.225; 13 -1.5,-2.225; 14 -0.9,-2.225; 15 -0.3,-2.225; 16 0.3,-2.225; 17 0.9,-2.225; 18 1.5,-2.225; 19 2.1,-2.225; 20 2.7,-2.225; 21 3.3,-2.225; 22 3.9,-2.225; 23 4.5,-2.225; 24 5.1,-2.225; 25 5.7,-2.225; 26 6.3,-2.225; 27 6.9,-2.225; 28 7.5,-2.225; 29 8.1,-2.225; 30 8.7,-2.225; 31 8.7,2.225; 32 8.1,2.225; 33 7.5,2.225; 34 6.9,2.225; 35 6.3,2.225; 36 5.7,2.225; 37 5.1,2.225; 38 4.5,2.225; 39 3.9,2.225; 40 3.3,2.225; 41 2.7,2.225; 42 2.1,2.225; 43 1.5,2.225; 44 0.9,2.225; 45 0.3,2.225; 46 -0.3,2.225; 47 -0.9,2.225; 48 -1.5,2.225; 49 -2.1,2.225; 50 -2.7,2.225; 51 -3.3,2.225; 52 -3.9,2.225; 53 -4.5,2.225; 54 -5.1,2.225; 55 -5.7,2.225; 56 -6.3,2.225; 57 -6.9,2.225; 58 -7.5,2.225; 59 -8.1,2.225; 60 -8.7,2.225 | hole 1.1: -11.1,-1.5 | hole 0.7: 11.1,-1.5
1X04-1MM-RA = smd 0.6 x 1.35: 1 -1.5,0; 2 -0.5,0; 3 0.5,0; 4 1.5,0 | smd 1.2 x 2: NC1 2.8,-3.675; NC2 -2.8,-3.675
1X03-1MM-RA = smd 0.6 x 1.35: 1 -1,0; 2 0,0; 3 1,0 | smd 1.2 x 2: NC1 2.3,-3.675; NC2 -2.3,-3.675
1X02-1MM-RA = smd 0.6 x 1.35: 1 -0.5,0; 2 0.5,0 | smd 1.2 x 2: NC1 1.8,-3.675; NC2 -1.8,-3.675

### Placement (x,y rotation side)
B1  0,0 0 top
BMS1:C1  4.7uF  [C0603]  27.3,29.21 90 top
BMS1:C2  100nF  [C0603]  29.21,29.21 90 top
BMS1:IC1  MAX8606  [DFN300X300X80-15N]  28.89,33.66 0 top
BMS1:R1  2k  [R0603]  31.11,29.21 90 top
C1  2.86,7.3 180 top
C2  7.3,2.22 90 top
C3  2.22,34.92 0 top
C4  25.08,29.21 270 top
C5  39.37,34.61 180 top
C6  34.92,2.22 90 top
C7  6.99,11.75 270 top
IC1  21.91,33.66 0 top
IC3  19.37,23.81 90 top
IC4  6.35,7.62 270 top
J1  3.81,13.34 270 top
MPPT1:C1  10uF  [C0603]  14.61,35.24 180 top
MPPT1:C2  1uF  [C0603]  8.89,26.67 270 top
MPPT1:C3  10uF  [C0603]  16.35,31.75 270 top
MPPT1:C4  4.7uF  [C0603]  10.79,19.05 90 top
MPPT1:C5  10nF  [C0603]  14.61,19.05 90 top
MPPT1:IC1  LTC3105  [SOP65P490X110-12N]  12.06,25.08 90 top
MPPT1:L1  10uH  [WE-TPC_3816]  12.7,31.43 180 top
MPPT1:R1  75k  [R0603]  12.54,19.05 90 top
MPPT1:R2  1M33  [R0603]  9.05,22.23 90 top
MPPT1:R3  392k  [R0603]  9.05,19.05 90 top
MPPT2:C1  10uF  [C0603]  6.35,35.24 180 top
MPPT2:C2  1uF  [C0603]  1.91,26.67 270 top
MPPT2:C3  10uF  [C0603]  18.26,31.75 270 top
MPPT2:C4  4.7uF  [C0603]  3.81,19.05 90 top
MPPT2:C5  10nF  [C0603]  7.3,19.05 90 top
MPPT2:IC1  LTC3105  [SOP65P490X110-12N]  5.08,25.08 90 top
MPPT2:L1  10uH  [WE-TPC_3816]  5.71,31.43 180 top
MPPT2:R1  75k  [R0603]  5.56,19.05 90 top
MPPT2:R2  1M33  [R0603]  2.06,22.23 90 top
MPPT2:R3  392k  [R0603]  2.06,19.05 90 top
PROT1:IC1  TPS2553DRVT  [SON65P200X200X80-7N]  38.73,12.06 90 top
PROT1:IC2  TPS2553DRVT  [SON65P200X200X80-7N]  23.4,16.83 90 top
PROT1:IC3  TPS2553DRVT  [SON65P200X200X80-7N]  21,16.83 90 top
PROT1:IC4  TPS2553DRVT  [SON65P200X200X80-7N]  18.6,16.83 90 top
PROT1:IC5  [SOT23-5]  29.21,23.18 0 top
PROT1:R1  27k  [R0603]  38.73,8.57 270 top
PROT1:R2  52k  [R0603]  23.4,13.02 270 top
PROT1:R3  52k  [R0603]  21,13.02 270 top
PROT1:R4  52k  [R0603]  18.6,13.02 270 top
PROT1:R5  0R025  [R1206]  32.07,23.18 90 top
PROT1:R6  10k 1%  [R0603]  26.04,21.27 180 top
PROT1:R7  820k 1%  [R0603]  26.04,25.08 180 top
PROT1:R8  200k 1%  [R0603]  26.04,23.18 0 top
PROT2:IC1  TPS2553DRVT  [SON65P200X200X80-7N]  35.88,12.06 90 top
PROT2:IC2  TPS2553DRVT  [SON65P200X200X80-7N]  30.6,16.83 90 top
PROT2:IC3  TPS2553DRVT  [SON65P200X200X80-7N]  28.2,16.83 90 top
PROT2:IC4  TPS2553DRVT  [SON65P200X200X80-7N]  25.8,16.83 90 top
PROT2:IC5  [SOT23-5]  38.1,18.1 270 top
PROT2:R1  27k  [R0603]  35.88,8.57 270 top
PROT2:R2  52k  [R0603]  30.6,13.02 270 top
PROT2:R3  52k  [R0603]  28.2,13.02 270 top
PROT2:R4  52k  [R0603]  25.8,13.02 270 top
PROT2:R5  0R025  [R1206]  38.1,15.24 0 top
PROT2:R6  10k 1%  [R0603]  36.2,21.59 90 top
PROT2:R7  820k 1%  [R0603]  40.01,21.59 90 top
PROT2:R8  200k 1%  [R0603]  38.1,21.59 270 top
R1  2.86,9.21 180 top
R15  9.53,11.38 180 top
R16  9.53,13.29 180 top
SMPS1:C1  10uF  [C0805]  34.92,34.29 180 top
SMPS1:C2  10uF  [C0805]  34.92,26.67 180 top
SMPS1:IC1  TPS63001  [DRC-S-PVSON-N10]  34.92,30.48 90 top
SMPS1:L1  2.2uH  [VLF4012A]  39.69,30.48 270 top
TP1  19.53,20 0 top
TP2  9.84,2.54 0 top
X1-BOT  21,7 0 bottom
X1-TOP  21,7 180 top
X2  18.41,36.83 180 top
X3  10.16,36.83 180 top
X4  26.04,36.83 180 top
X5  32.7,36.83 180 top

### Tracks (layer width: path | path; a pad name or v marks a point on that pad's centre or on a via)
!RST  (via drill 0.33)
  Top 0.254: X1-TOP.27 v14.1,11.11 13.97,11.11 13.97,12.06 v12.7,13.34 | IC4.1 5.39,8.57 v6.03,9.21
  Bottom 0.254: X1-BOT.27 v14.1,11.11 | v6.03,9.21 10.16,13.34 v12.7,13.34
+3V3_I_SEN  (via drill 0.33)
  Top 0.254: v21.91,28.57 20.61,27.28 IC3.18 | PROT2:R6.1 35.3,20.74 34.92,21.11 34.92,21.43 v34.45,21.91
  Top 0.406: PROT2:R6.1 36.2,19.05 PROT2:IC5.1
  Bottom 0.254: v21.91,28.57 29.53,28.57 30.16,27.94 30.16,26.19 v34.45,21.91
+3V3_SW[0]_!FAULT!  (via drill 0.33)
  Top 0.254: PROT2:IC1.3 v37.15,10.48 | IC3.14 22.83,24.57 v23.02,24.77
  Bottom 0.254: v37.15,10.48 39.05,12.38 39.05,17.14 38.26,17.94 35.66,17.94 35.08,18.52 35.08,19.21 29.21,25.08 23.34,25.08 v23.02,24.77
+3V3_SW[1]  (via drill 0.33)
  Top 0.406: PROT2:IC2.1 29.94,15.49 29.4,14.95 v29.4,11.11
  pour Top (no thermals): 28.95,11.5 29.85,11.5 29.85,8 28.95,8
  pour Bottom (no thermals): 28.95,11.5 29.85,11.5 29.85,8 28.95,8
+3V3_SW[1]_!FAULT!  (via drill 0.33)
  Top 0.254: IC3.13 22.29,24.07 22.38,23.97 v23.02,23.97 | PROT2:IC2.3 31.53,15.81 31.75,16.03 v31.75,20
  Bottom 0.254: v23.02,23.97 23.65,24.61 29.05,24.61 30.8,22.86 30.8,20.95 v31.75,20
+3V3_SW[1]_EN  (via drill 0.33)
  Top 0.254: IC3.12 22.48,23.56 22.7,23.34 23.34,23.34 v23.65,23.65 | PROT2:IC2.4 31.26,19.7 v30.8,20.16
  Bottom 0.254: v23.65,23.65 24.13,24.13 28.89,24.13 30.16,22.86 30.16,20.8 v30.8,20.16
+3V3_SW[2]  (via drill 0.33)
  Top 0.406: PROT2:IC3.1 27.54,15.47 27,14.94 v27,11.11
  pour Top (no thermals): 26.55,11.5 27.45,11.5 27.45,8 26.55,8
  pour Bottom (no thermals): 26.55,11.5 27.45,11.5 27.45,8 26.55,8
+3V3_SW[2]_!FAULT!  (via drill 0.33)
  Top 0.254: IC3.11 22.35,23.05 22.7,22.7 23.18,22.7 v23.5,22.38 | PROT2:IC3.3 29.15,15.81 29.37,16.03 29.37,18.41 27.78,20 v27.78,20.16
  Bottom 0.254: v27.78,20.16 27.3,20.64 24.45,20.64 23.5,21.59 v23.5,22.38
+3V3_SW[2]_EN  (via drill 0.33)
  Top 0.254: PROT2:IC3.4 28.86,18.29 27.15,20 v26.99,20 | IC3.10 22.26,22.57 22.86,21.97 v22.86,21.91
  Bottom 0.254: v26.99,20 24.45,20 22.86,21.59 v22.86,21.91
+3V3_SW[3]  (via drill 0.33)
  Top 0.406: PROT2:IC4.1 25.14,15.46 24.6,14.92 v24.6,11.11
  pour Top (no thermals): 24.15,11.5 25.05,11.5 25.05,8 24.15,8
  pour Bottom (no thermals): 24.15,11.5 25.05,11.5 25.05,8 24.15,8
+3V3_SW[3]_!FAULT!
  Top 0.254: IC3.9 21.97,22.06 22.23,21.81 22.23,21.59 23.97,19.84 25.4,19.84 26.99,18.26 26.99,16.03 26.77,15.81 PROT2:IC4.3
+3V3_SW[3]_EN
  Top 0.254: IC3.8 21.78,21.4 23.81,19.37 25.24,19.37 26.46,18.15 PROT2:IC4.4
+3V3_UNPRO  (via drill 0.33)
  Top 0.254: 32.7,26.99 29.84,26.99 29.21,26.35 24.77,26.35 23.81,27.3 v22.23,27.3 | IC3.3 18.61,20.45 v18.73,20.32 | v17.3,19.37 17.14,19.21 17.14,16.83 14.61,14.29 7.62,14.29 v7.3,13.97 6.99,13.65 C7.1 | R1.2 2.01,9.42 1.27,10.16 1.27,15.24 1.91,15.88 J1.1
  Top 0.305: SMPS1:IC1.10 32.97,29.48 32.7,29.21 v32.7,27.94 32.7,26.99 33.02,26.67 SMPS1:C2.2 | SMPS1:IC1.1 36.88,29.48 37.15,29.21 v37.15,27.94
  Top 0.406: PROT2:R7.1 40.01,19.05 PROT2:IC5.5 PROT2:IC5.4 39.4,15.24 PROT2:R5.2 v40.96,15.24
  Bottom 0.254: J1.1 4.13,16.83 5.08,16.83 6.67,15.24 6.99,15.24 7.3,14.92 v7.3,13.97 | v22.23,27.3 21.59,27.3 18.73,24.45 v18.73,20.32 17.46,20.32 17.14,20 17.14,19.53 v17.3,19.37
  Bottom 0.305: v37.15,27.94 v32.7,27.94
  Bottom 0.406: v37.15,27.94 40.96,24.13 v40.96,15.24
+3V3_V_SEN  (via drill 0.33)
  Top 0.254: v39.05,23.5 39.05,22.44 | IC3.19 20.13,27.43 21.27,28.57 21.27,28.89 21.59,29.21 v22.54,29.21
  Top 0.406: PROT2:R7.2 39.05,22.44 PROT2:R8.1
  Bottom 0.254: v39.05,23.5 38.73,23.81 33.34,23.81 30.8,26.35 30.8,28.26 29.84,29.21 v22.54,29.21
BMS1:BATT_PROG
  Top 0.254: BMS1:IC1.12 31.34,34.06 31.75,33.66 31.75,31.43 31.11,30.8 BMS1:R1.2
BMS1:VL
  Top 0.254: BMS1:IC1.4 25.88,33.66 25.56,33.34 25.56,31.59 26.04,31.11 28.89,31.11 29.21,30.8 BMS1:C2.2
BMS_!CHG!  (via drill 0.33)
  Top 0.254: BMS1:IC1.6 26.99,32.87 26.35,32.23 v26.35,32.07 | IC3.21 19.11,28.16 v19.21,28.26
  Bottom 0.254: v26.35,32.07 24.77,32.07 23.02,30.32 21.27,30.32 v19.21,28.26
BMS_!PGD!  (via drill 0.33)
  Top 0.254: BMS1:IC1.7 27.39,32 v27.15,31.75 | IC3.20 19.62,27.88 v20,28.26
  Bottom 0.254: v27.15,31.75 26.83,31.43 24.77,31.43 23.18,29.84 21.59,29.84 v20,28.26
GND  (via drill 0.33)
  other vias: 12.34,6.99 29.48,6.99 27,2.85 40.96,6.35 34.92,4.29 37.47,34.61 13.65,21.59 9.84,16.83 6.99,21.27 9.84,39.05 4.13,34.92 29.21,20.64 37.47,26.04 8.89,24.61 5.71,24.13 4.76,20.95 12.7,24.13 11.75,20.95 2.06,16.99 1.91,24.61 25.8,2.85 22.2,2.86 21,2.86 14.61,27.3 18.6,11.11 21,11.11 23.4,11.11 25.8,11.11 28.2,11.11 16.2,11.11 30.6,11.11 18.73,16.83 30.64,16.83 29.84,31.43 18.73,39.05 26.04,39.05 32.38,34.77 28.57,26.99 29.21,36.2 6.35,36.83 14.61,36.83 9.21,31.43 19.37,33.66 21.91,35.88 21.91,31.43 17.46,29.53 34.45,12.06 35.56,6.35 11.11,3.49 21.91,19.53 20,23.34 26.35,26.99 41.12,12.06 34.92,17.62 34.61,23.02 36.2,24.61 40.96,26.35 35.56,36.2 28.26,16.83 25.88,16.83 23.5,16.83 26.04,22.23 21.27,16.83 6.99,4.45 7.94,6.35 0.95,6.35 33.66,32.23 18.1,24.92
  pour Top (rank 6): 42,42 0,42 0,0 42,0
  pour Bottom (rank 6): 42,42 0,42 0,0 42,0
  pour Bottom (rank 4, no thermals): 10.75,11.75 30.75,11.75 30.75,0.95 10.75,0.95
  pour Top (rank 4, no thermals): 10.75,11.43 30.75,11.43 30.75,0.95 10.75,0.95
  pour Top (rank 4, no thermals): 19.37,31.43 19.37,35.56 24.13,35.56 24.13,31.43
  pour Top (rank 2, no thermals): 15.88,27.3 22.86,27.3 22.86,20.32 15.88,20.32
  pour Top (no thermals): 26.67,35.24 31.11,35.24 31.11,31.75 26.67,31.75
  pour Top (no thermals): 32.7,27.94 32.7,33.02 37.15,33.02 37.15,27.94
GPIO[0]  (via drill 0.33)
  Top 0.254: X1-TOP.25 v15.3,11.11
  Bottom 0.254: v15.3,11.11 X1-BOT.25
GPIO[1]  (via drill 0.33)
  Top 0.254: X1-TOP.26 v14.7,11.75
  Bottom 0.254: v14.7,11.75 X1-BOT.26
GPIO[2]  (via drill 0.33)
  Top 0.254: X1-TOP.34 v14.1,2.22
  Bottom 0.254: v14.1,2.22 X1-BOT.34
GPIO[3]  (via drill 0.33)
  Top 0.254: v14.7,2.86 X1-TOP.35
  Bottom 0.254: X1-BOT.35 v14.7,2.86
GPIO[4]  (via drill 0.33)
  Top 0.254: X1-TOP.36 v15.3,2.22
  Bottom 0.254: v15.3,2.22 X1-BOT.36
GPIO[5]  (via drill 0.33)
  Top 0.254: v15.9,2.86 X1-TOP.37
  Bottom 0.254: X1-BOT.37 v15.9,2.86
GPIO[6]  (via drill 0.33)
  Top 0.254: v16.5,2.22 X1-TOP.38
  Bottom 0.254: X1-BOT.38 v16.5,2.22
GPIO[7]  (via drill 0.33)
  Top 0.254: X1-TOP.39 v17.1,2.86 arc-90 v17.1,2.86
  Bottom 0.254: v17.1,2.86 X1-BOT.39 arc-90 X1-BOT.39
GPIO[8]  (via drill 0.33)
  Top 0.254: v17.7,2.22 X1-TOP.40
  Bottom 0.254: X1-BOT.40 v17.7,2.22
GPIO[9]  (via drill 0.33)
  Top 0.254: X1-TOP.41 v18.3,2.86
  Bottom 0.254: v18.3,2.86 X1-BOT.41
GPIO[10]  (via drill 0.33)
  Top 0.254: v18.9,2.22 X1-TOP.42
  Bottom 0.254: X1-BOT.42 v18.9,2.22
GPIO[11]  (via drill 0.33)
  Top 0.254: X1-TOP.43 v19.5,2.86
  Bottom 0.254: v19.5,2.86 X1-BOT.43
GPIO[12]  (via drill 0.33)
  Top 0.254: X1-TOP.44 v20.1,2.22
  Bottom 0.254: v20.1,2.22 X1-BOT.44
I2C_INT  (via drill 0.33)
  Top 0.254: IC3.25 16.95,26.86 v16.99,26.83 | v17.14,28.57 14.92,28.57 v14.61,28.26 | v9.84,3.49 TP2.P$1
  Bottom 0.254: v16.99,26.83 16.99,28.42 v17.14,28.57 | v14.61,28.26 3.17,28.26 2.86,28.57 1.11,28.57 0.79,28.26 0.79,10 3.17,7.62 8.26,7.62 9.84,6.03 v9.84,3.49
I2C_SCL  (via drill 0.33)
  Top 0.254: X1-TOP.29 v12.9,11.11 10.72,13.29 R16.1 | IC3.23 18.12,27.6 17.78,27.94 16.52,27.94 14.61,26.03 14.61,22.23 v14.45,22.07
  Bottom 0.254: X1-BOT.29 v12.9,11.11 12.9,11.95 15.08,14.13 15.08,21.43 v14.45,22.07
I2C_SDA  (via drill 0.33)
  Top 0.254: X1-TOP.30 12.3,10.79 v11.98,11.11 11.71,11.38 R15.1 | IC3.24 17.61,27.31 17.46,27.46 16.67,27.46 15.08,25.88 15.08,21.91 v14.45,21.27
  Bottom 0.254: X1-BOT.30 12.3,10.79 v11.98,11.11 12.38,11.51 12.38,12.06 14.61,14.29 14.61,21.11 v14.45,21.27
IDIODE_STAT  (via drill 0.33)
  Top 0.254: IC1.9 23.94,34.16 v24.45,33.66 | IC3.22 18.61,28.07 v18.41,28.26
  Bottom 0.254: v24.45,33.66 24.45,32.38 22.86,30.8 20.95,30.8 v18.41,28.26
MPPT1:AUX
  Top 0.254: MPPT1:IC1.12 10.44,27.52 MPPT1:C2.1
MPPT1:FB
  Top 0.254: MPPT1:R2.1 9.05,20.64 | 9.05,20.64 MPPT1:R3.2 | MPPT1:IC1.1 10.44,21.18 9.9,20.64 9.05,20.64
MPPT1:LDO
  Top 0.254: MPPT1:IC1.2 11.1,20.94 10.79,20.64 MPPT1:C4.2
MPPT1:MPPC
  Top 0.254: MPPT1:IC1.5 13.03,21.13 12.54,20.64 MPPT1:R1.2
MPPT1:SW
  Top 0.406: MPPT1:IC1.9 12.39,28.56 12.06,28.89 11.43,28.89 11.34,28.98 MPPT1:L1.2
MPPT1:THM
  Top 0.406: MPPT1:C5.1 MPPT1:R1.1
MPPT2:AUX
  Top 0.254: MPPT2:IC1.12 3.45,27.52 MPPT2:C2.1
MPPT2:FB
  Top 0.254: MPPT2:R2.1 2.06,20.64 | 2.06,20.64 MPPT2:R3.2 | MPPT2:IC1.1 3.45,21.18 2.91,20.64 2.06,20.64
MPPT2:LDO
  Top 0.254: MPPT2:IC1.2 4.12,20.95 3.81,20.65 MPPT2:C4.2
MPPT2:MPPC
  Top 0.254: MPPT2:IC1.5 6.04,21.11 5.56,20.62 MPPT2:R1.2
MPPT2:SW
  Top 0.406: MPPT2:IC1.9 5.41,28.56 5.08,28.89 4.45,28.89 4.36,28.98 MPPT2:L1.2
MPPT2:THM
  Top 0.406: MPPT2:C5.1 MPPT2:R1.1
MPPT_PGD  (via drill 0.33)
  Top 0.254: v7.62,24.92 7.62,26.19 7.94,26.51 7.94,28.1 8.41,28.57 9.84,28.57 10.16,28.26 11.59,28.26 11.73,28.11 MPPT1:IC1.10 | MPPT2:IC1.10 4.75,25.41 v5.08,25.08 | IC3.26 16.38,25.06 16.19,25.24 16.19,26.04 v16.35,26.19
  Bottom 0.254: v16.35,26.19 14.29,24.13 14.29,23.18 13.97,22.86 7.94,22.86 7.62,23.18 v7.62,24.92 7.46,25.08 v5.08,25.08
N$1
  Top 0.254: B1.1 6.03,1.59 C2.1
N$2
  Top 0.254: B1.2 1.59,36.04 C3.1
N$3
  Top 0.254: B1.3 40.01,35.88 C5.1
N$4
  Top 0.254: B1.4 36.2,1.59 36.18,1.57 C6.1
N$5
  Top 0.254: IC3.4 19.11,20.89 19.53,20.48 TP1.P$1
PRO1  (via drill 0.33)
  Top 0.254: R16.2 R15.2 8.68,10.58 6.19,8.1 6.19,7.46 5.4,6.67 | 5.4,6.67 IC4.2 4.66,6.67 C1.1 | 5.4,6.67 6.04,6.03 v6.35,6.03
  Top 0.406: PROT2:IC1.1 35.22,10.45 34.61,9.84 34.61,6.9 30.57,2.86 v29.4,2.86 v29.4,2.85
  Bottom 0.254: 28.8,2.86 28.8,1.59 28.32,1.11 9.53,1.11 8.57,2.06 8.57,4.13 6.67,6.03 v6.35,6.03
  other vias: 28.2,2.85
  pour Top (no thermals): 27.75,6 29.85,6 29.85,2.54 27.75,2.54
  pour Bottom (no thermals): 27.75,6 29.85,6 29.85,2.54 27.75,2.54
PROT1:I_LIM_SW1
  Top 0.254: PROT1:IC2.2 23.4,15.3 23.18,15.08 23.18,14.09 PROT1:R2.1
PROT1:I_LIM_SW2
  Top 0.254: PROT1:IC3.2 21,15.29 20.8,15.08 20.8,14.07 PROT1:R3.1
PROT1:I_LIM_SW3
  Top 0.254: PROT1:IC4.2 18.6,15.27 18.41,15.08 18.41,14.05 PROT1:R4.1
PROT1:I_LIM_VCC
  Top 0.254: PROT1:IC1.2 PROT1:R1.1
PROT1:IN_SEN  (via drill 0.33)
  Top 0.254: PROT1:R5.1 30.16,21.76 PROT1:IC5.3
  Top 0.406: PROT1:IC4.6 17.94,18.57 v17.94,18.73 | PROT1:IC3.6 20.34,18.71 v20.32,18.73 | PROT1:IC2.6 22.74,18.54 v22.54,18.73 | PROT1:IC1.4 39.4,13.63 39.21,13.81 v38.26,13.81 38.08,13.63 PROT1:IC1.6 | PROT1:R5.1 32.07,20.64 32.38,20.32 v32.38,19.37
  Bottom 0.406: v17.94,18.73 v20.32,18.73 v22.54,18.73 23.18,19.37 v32.38,19.37 33.34,18.41 33.34,16.51 34.61,15.24 37.62,15.24 38.26,14.61 v38.26,13.81
PROT2:I_LIM_SW1
  Top 0.254: PROT2:IC2.2 PROT2:R2.1
PROT2:I_LIM_SW2
  Top 0.254: PROT2:IC3.2 PROT2:R3.1
PROT2:I_LIM_SW3
  Top 0.254: PROT2:IC4.2 PROT2:R4.1
PROT2:I_LIM_VCC
  Top 0.254: PROT2:IC1.2 PROT2:R1.1
PROT2:IN_SEN  (via drill 0.33)
  Top 0.406: PROT2:IC4.6 25.14,18.52 v24.92,18.73 | PROT2:IC3.6 27.54,18.66 v27.46,18.73 | PROT2:IC2.6 29.94,18.64 v29.84,18.73 | PROT2:IC5.3 36.8,15.24 PROT2:R5.1 35.56,15.24 35.24,14.92 35.24,14.29 v35.56,13.97 | PROT2:IC1.4 36.54,13.63 36.2,13.97 v35.56,13.97 | PROT2:IC1.6 35.22,13.68 35.51,13.97 v35.56,13.97
  Bottom 0.406: v24.92,18.73 v27.46,18.73 v29.84,18.73 32.07,18.73 32.7,18.1 32.7,16.19 34.92,13.97 v35.56,13.97
RESET
  Top 0.254: IC3.31 16.54,22.57 16.19,22.23 16.19,17.14 14.29,15.24 6.35,15.24 5.4,14.29 5.4,11.75 J1.10 4.45,9.95 R1.1
S_ARRAY_1  (via drill 0.33)
  Top 0.406: MPPT1:IC1.11 v11.1,25.7 9.05,23.65 MPPT1:R2.2 | IC1.1 19.65,34.65 v19.37,34.92 19.05,34.61 17.46,34.61 16.35,33.5 MPPT1:C3.1
  Bottom 0.406: v11.1,25.7 13.98,25.7 15.56,27.29 15.56,32.7 17.46,34.61 19.05,34.61 v19.37,34.92
S_ARRAY_2  (via drill 0.33)
  Top 0.406: MPPT2:IC1.11 v4.12,25.7 2.06,23.65 MPPT2:R2.2 | IC1.5 19.65,32.66 v19.37,32.38 19.15,32.6 MPPT2:C3.1
  Bottom 0.406: v4.12,25.7 10.15,25.7 10.95,24.92 14.12,24.92 16.19,26.99 16.19,32.38 16.51,32.7 19.05,32.7 v19.37,32.38
SMPS1:N$1
  Top 0.406: SMPS1:IC1.4 37.33,30.98 38.73,32.38 SMPS1:L1.P$1
  pour Top (no thermals): 37.15,30.96 40.64,30.96 40.64,33.02 39.05,33.02 37.15,31.11
SMPS1:N$2
  Top 0.406: SMPS1:IC1.2 37.33,29.98 38.73,28.57 SMPS1:L1.P$2
  pour Top (no thermals): 37.15,30 40.64,30 40.64,27.94 39.05,27.94 37.15,29.84
SOLAR[1..2]
  Top 0.406: X2.2 18.91,35.74 18.73,35.56 17.14,35.56 16.91,35.79 | X2.4 16.91,35.79 | MPPT1:IC1.8 13.03,28.59 13.34,28.89 13.97,28.89 14.06,28.98 MPPT1:L1.1 14.06,32.79 15.46,34.19 MPPT1:C1.1 16.37,35.24 16.91,35.79
SOLAR[3..4]
  Top 0.406: X3.4 8.66,35.79 | 8.66,35.79 8.89,35.56 10.48,35.56 10.66,35.74 X3.2 | MPPT2:IC1.8 6.04,28.59 6.35,28.89 6.99,28.89 7.07,28.98 MPPT2:L1.1 7.2,31.58 MPPT2:C1.1 8.11,35.24 8.66,35.79
SPI_MISO  (via drill 0.33)
  Top 0.254: X1-TOP.32 v12.9,2.22
  Bottom 0.254: v12.9,2.22 X1-BOT.32
SPI_MOSI  (via drill 0.33)
  Top 0.254: X1-TOP.31 v12.3,2.86
  Bottom 0.254: X1-BOT.31 v12.3,2.86
SPI_SCK  (via drill 0.33)
  Top 0.254: X1-TOP.33 v13.5,2.86
  Bottom 0.254: v13.5,2.86 X1-BOT.33
SWD_CLK
  Top 0.254: IC3.30 16.38,23.05 15.72,22.38 15.72,17.3 14.13,15.72 6.19,15.72 5.08,14.61 J1.4
SWD_DIO  (via drill 0.33)
  Top 0.254: IC3.32 16.67,22.06 16.67,16.99 14.45,14.76 6.83,14.76 v6.67,14.61
  Bottom 0.254: v6.67,14.61 5.4,15.88 J1.2
THM  (via drill 0.33)
  Top 0.254: BMS1:IC1.5 26.58,33.25 v26.35,33.02 | v26.04,35.56 X4.2
  Bottom 0.254: v26.35,33.02 26.35,35.24 v26.04,35.56
V_BAT
  Top 0.254: BMS1:IC1.1 BMS1:IC1.2 27.39,34.58 27.46,34.65
  Top 0.406: X4.3 25.04,35.29 25.68,34.65 27.46,34.65
VBAT  (via drill 0.33)
  Top 0.406: 24,2.86 24,1.91 24.32,1.59 30.8,1.59 34.61,5.4 35.88,5.4 37.47,6.99 37.47,9.84 38.08,10.45 PROT1:IC1.1
  other vias: 24.6,2.85 23.4,2.85
  pour Bottom (no thermals): 22.96,6 25.05,6 25.05,2.54 22.96,2.54
  pour Top (no thermals): 22.96,6 25.05,6 25.05,2.54 22.96,2.54
VBAT_I_SEN  (via drill 0.33)
  Top 0.254: PROT1:IC5.1 28.26,21.27 | 28.26,21.27 PROT1:R6.1 | IC3.16 21.78,25.91 22.07,26.19 23.65,26.19 23.81,26.04 23.81,24.45 24.29,23.97 24.29,21.91 v24.13,21.75 | v28.26,20.8 28.26,21.27
  Bottom 0.254: v24.13,21.75 24.61,21.27 27.78,21.27 v28.26,20.8
VBAT_SW[0]_!FAULT!  (via drill 0.33)
  Top 0.254: PROT1:IC1.3 v40.01,10.48 | IC3.15 22.36,25.06 v22.86,25.56
  Bottom 0.254: v22.86,25.56 29.37,25.56 35.56,19.37 35.56,18.73 35.88,18.41 39.69,18.41 40.32,17.78 40.32,10.79 v40.01,10.48
VBAT_SW[1]  (via drill 0.33)
  Top 0.406: PROT1:IC2.1 22.74,15.44 22.2,14.9 v22.2,11.11
  pour Top (no thermals): 21.75,11.5 22.65,11.5 22.65,8 21.75,8
  pour Bottom (no thermals): 21.75,11.5 22.65,11.5 22.65,8 21.75,8
VBAT_SW[1]_!FAULT!  (via drill 0.33)
  Top 0.254: IC3.27 16.07,24.57 v15.88,24.77 | PROT1:IC2.3 24.06,15.01 v23.97,14.92
  Bottom 0.254: v15.88,24.77 15.56,24.77 14.76,23.97 14.76,22.7 15.56,21.91 15.56,14.61 16.83,13.34 22.38,13.34 v23.97,14.92
VBAT_SW[1]_EN
  Top 0.254: IC3.7 20.61,20.82 20.8,20.64 21.82,20.64 24.06,18.39 PROT1:IC2.4
VBAT_SW[2]  (via drill 0.33)
  Top 0.406: v19.8,11.11 19.8,14.88 20.34,15.42 PROT1:IC3.1
  pour Bottom (no thermals): 19.35,11.5 20.25,11.5 20.25,8 19.35,8
  pour Top (no thermals): 19.35,11.5 20.25,11.5 20.25,8 19.35,8
VBAT_SW[2]_!FAULT!  (via drill 0.33)
  Top 0.254: IC3.28 15.65,24.07 v15.56,23.97 | PROT1:IC3.3 21.66,15.15 v21.43,14.92
  Bottom 0.254: v15.56,23.97 15.24,23.65 15.24,22.86 16.03,22.07 16.03,14.92 17.14,13.81 20.32,13.81 v21.43,14.92
VBAT_SW[2]_EN
  Top 0.254: IC3.2 18.12,19.98 18.73,19.37 20.6,19.37 21.66,18.31 PROT1:IC3.4
VBAT_SW[3]  (via drill 0.33)
  Top 0.406: PROT1:IC4.1 17.94,15.4 17.4,14.86 v17.4,11.11
  pour Top (no thermals): 16.95,11.5 17.85,11.5 17.85,8 16.95,8
  pour Bottom (no thermals): 16.95,11.5 17.85,11.5 17.85,8 16.95,8
VBAT_SW[3]_!FAULT!  (via drill 0.33)
  Top 0.254: IC3.29 16.1,23.56 v15.88,23.34 | PROT1:IC4.3 19.26,15.13 v19.05,14.92
  Bottom 0.254: v15.88,23.34 15.88,22.86 16.51,22.23 16.51,15.24 17.46,14.29 18.41,14.29 v19.05,14.92
VBAT_SW[3]_EN
  Top 0.254: PROT1:IC4.4 19.26,18.3 18.19,19.37 17.61,19.94 IC3.1
VBAT_V_SEN
  Top 0.254: PROT1:R7.2 25.18,24.13 | 25.18,24.13 24.61,24.13 24.29,24.45 24.29,26.22 23.84,26.67 21.91,26.67 21.46,26.23 IC3.17 | 25.18,24.13 PROT1:R8.1
VSOL
  Top 0.254: 27.3,30.16 BMS1:C1.2 27.2,30.16
  Top 0.305: BMS1:IC1.3 25.49,34.06 | 25.49,34.06 25.08,33.66 25.08,33.02 24.73,32.66 | 27.2,30.16 C4.1 25.08,32.31 24.73,32.66 | IC1.10 24.91,34.65 25.49,34.06 | IC1.6 24.73,32.66
VSYS
  Top 0.254: BMS1:IC1.14 BMS1:IC1.13 30.48,34.53 30.48,34.61
  Top 0.406: X5.2 32.2,35.7 31.11,34.61 30.48,34.61 30.32,34.61
VSYS_SW  (via drill 0.3, 0.33)
  Top 0.254: PROT1:R5.2 30.28,24.6 PROT1:IC5.4 PROT1:IC5.5 28.26,25.08 PROT1:R7.1
  Top 0.305: SMPS1:IC1.5 36.88,31.48 37.15,31.75 v37.15,33.02 | SMPS1:IC1.6 32.75,31.48 32.7,31.43 | SMPS1:IC1.7 32.7,30.98 | SMPS1:IC1.8 32.7,30.48
  Top 0.406: 32.7,30.48 v32.7,30.96 32.7,30.98 32.7,31.43 v32.7,33.02 32.7,33.97 33.02,34.29 SMPS1:C1.2 33.98,35.24 33.2,36.01 X5.1 | v32.07,26.35 PROT1:R5.2
  Bottom 0.406: v37.15,33.02 v32.7,33.02 | v32.7,30.96 32.07,30.32 v32.07,26.35

### Text on the board
Top: Top
Bottom: Bot
tPlace: ISSUE A | PQ60-EPS